# EAGLE design Schematic (EAGLE 9.6.2)

## Sheet 1 of 2
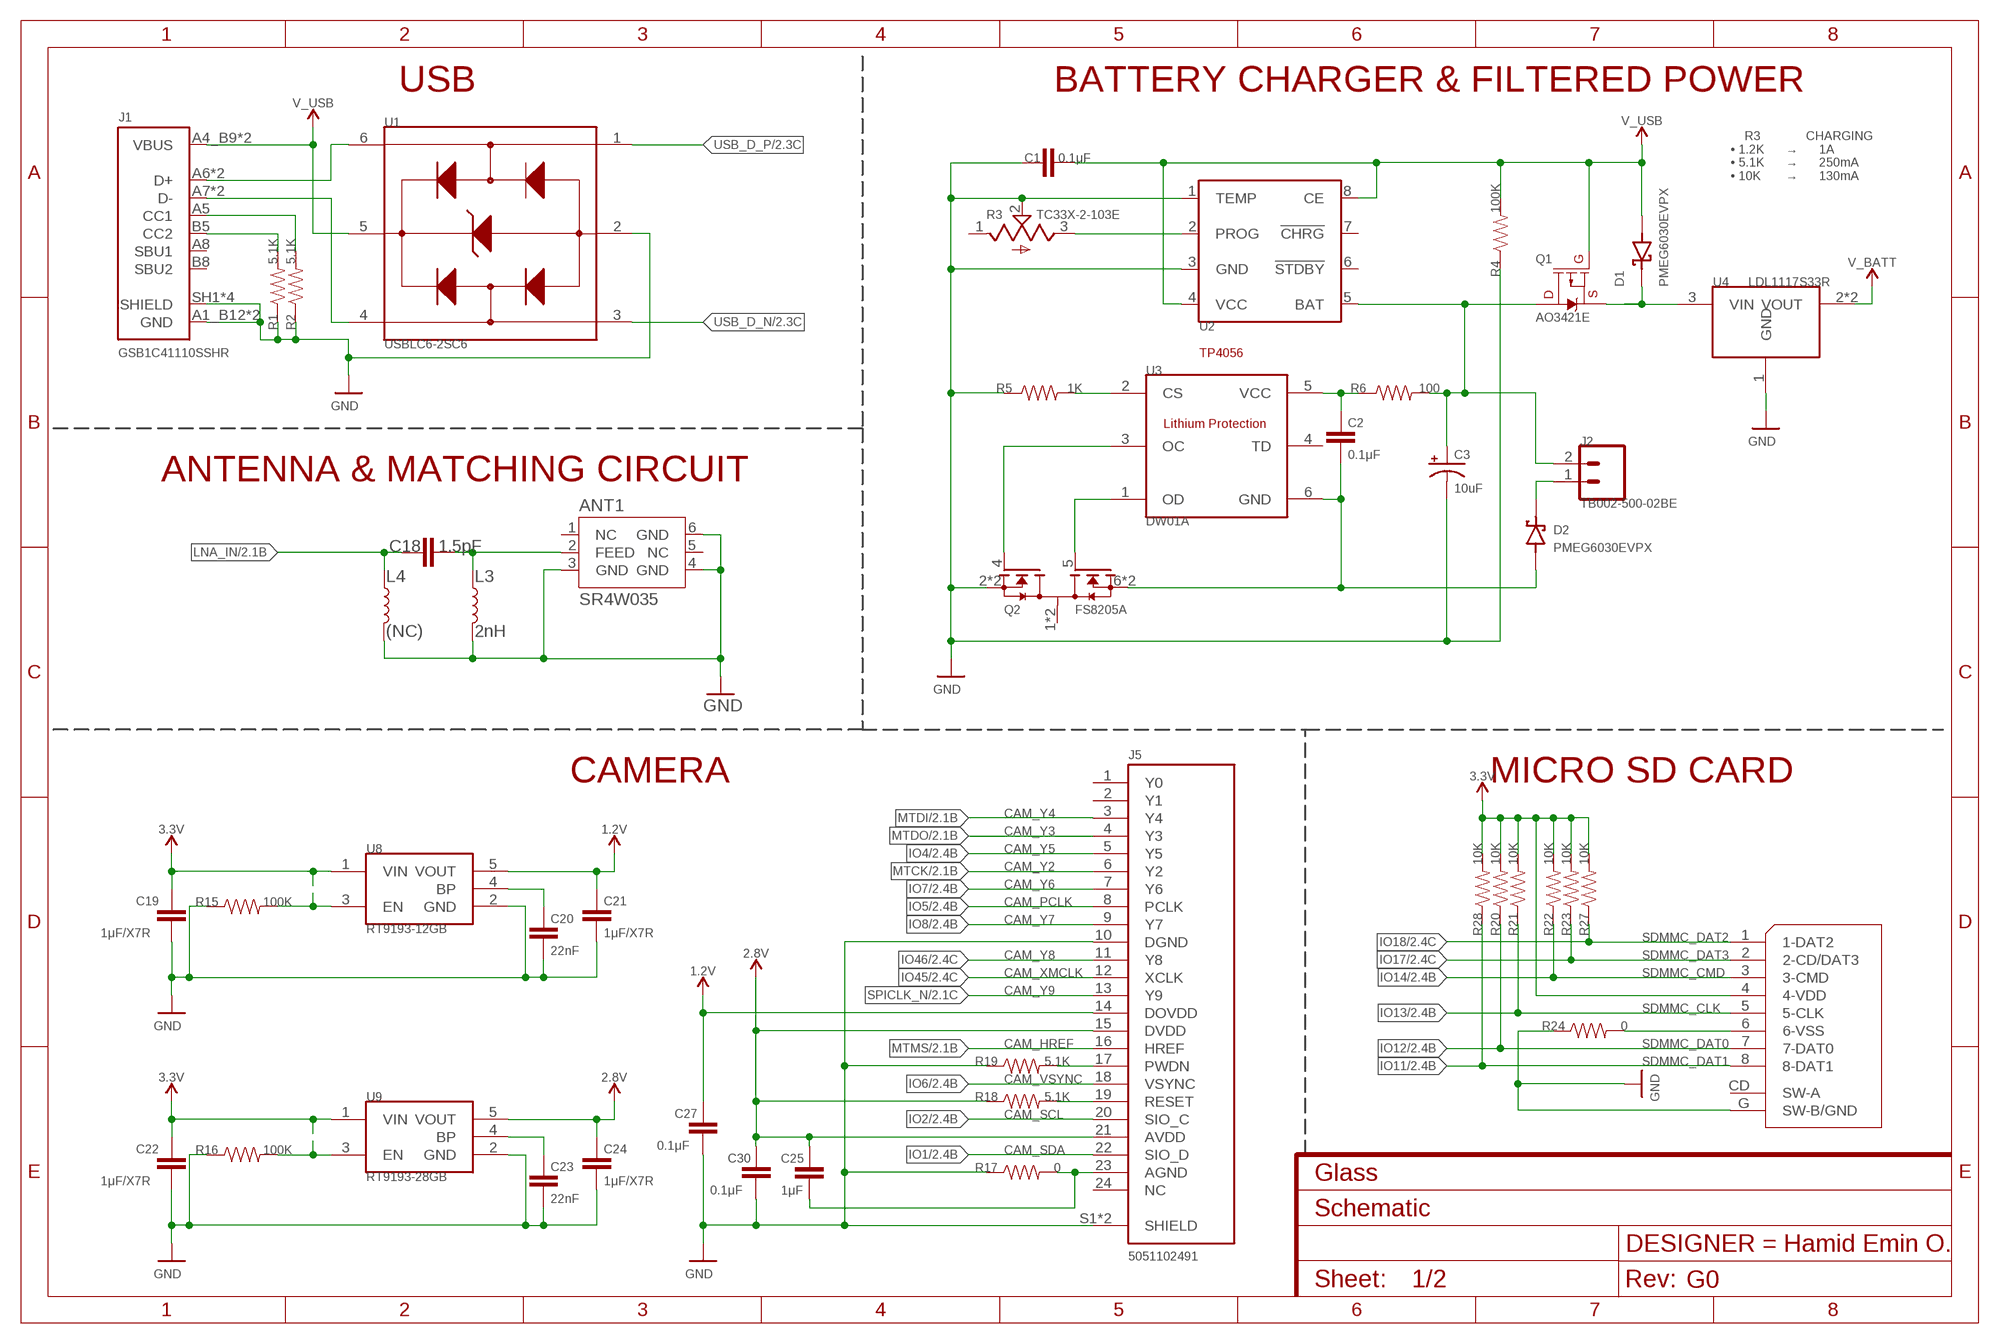
[diagram p0: schematic, sheet 1]
FRAME1 (FRAME-A4L): CNAME: Glass; CREVISION: G0; DESIGNER: Hamid Emin O.

### Parts
ANT1  SR4W035  [SR4W035]
C1  0.1μF  1.0UF-0805-25V-10%  [0805]
C2  0.1μF  1.0UF-0805-25V-10%  [0805]
C3  10uF  10UF-POLAR-RADIAL-2.5MM-25V-20%  [CPOL-RADIAL-2.5MM-5MM]
C18  1.5pF  15PF-0402-50V-5%  [0402]
C19  1μF/X7R  1.0UF-0805-25V-10%  [0805]
C20  22nF  10NF-0603-50V-10%  [0603]
C21  1μF/X7R  1.0UF-0805-25V-10%  [0805]
C22  1μF/X7R  1.0UF-0805-25V-10%  [0805]
C23  22nF  10NF-0603-50V-10%  [0603]
C24  1μF/X7R  1.0UF-0805-25V-10%  [0805]
C25  1μF  1.0UF-0805-25V-10%  [0805]
C27  0.1μF  1.0UF-0805-25V-10%  [0805]
C30  0.1μF  1.0UF-0805-25V-10%  [0805]
D1  PMEG6030EVPX  [DIO_PMEG6030EVPX]
D2  PMEG6030EVPX  [DIO_PMEG6030EVPX]
J1  GSB1C41110SSHR  [AMPHENOL_GSB1C41110SSHR]
J2  TB002-500-02BE  CONN_025MM  [SCREWTERMINAL-5MM-2]
J5  5051102491  [MOLEX_5051102491]
K1  112J-TDAR-R01  [112J-TDAR-R01]
L3  2nH  INDUCTOR-0402-3.9NH  [0402]
L4  (NC)  INDUCTOR-0402-3.9NH  [0402]
Q1  AO3421E  MOSFET_PCH-DMG2307L  [SOT23-3]
Q2  FS8205A  [SOP65P640X120-8N]
R1  5.1K  5.1KOHM5.1KOHM-0603-1/10W-1%  [0603]
R2  5.1K  5.1KOHM5.1KOHM-0603-1/10W-1%  [0603]
R3  TC33X-2-103E  [TRIM_TC33X-2-103E]
R4  100K  0OHM-0603-1/10W  [0603]
R5  1K  1KOHM-0603-1/10W-1%  [0603]
R6  100  100OHM-0603-1/10W-1%  [0603]
R15  100K  0OHM-0603-1/10W  [0603]
R16  100K  0OHM-0603-1/10W  [0603]
R17  0  0OHM-0603-1/10W  [0603]
R18  5.1K  5.1KOHM5.1KOHM-0603-1/10W-1%  [0603]
R19  5.1K  5.1KOHM5.1KOHM-0603-1/10W-1%  [0603]
R20  10K  5.1KOHM5.1KOHM-0603-1/10W-1%  [0603]
R21  10K  5.1KOHM5.1KOHM-0603-1/10W-1%  [0603]
R22  10K  5.1KOHM5.1KOHM-0603-1/10W-1%  [0603]
R23  10K  5.1KOHM5.1KOHM-0603-1/10W-1%  [0603]
R24  0  0OHM-0603-1/10W  [0603]
R27  10K  5.1KOHM5.1KOHM-0603-1/10W-1%  [0603]
R28  10K  5.1KOHM5.1KOHM-0603-1/10W-1%  [0603]
U1  USBLC6-2SC6  [SOT95P280X145-6N]
U2  TP4056  [SOT23-8]
U3  DW01A  [SOT23-6]
U4  LDL1117S33R  [SOT230P700X180-4N]
U8  RT9193-12GB  RT9193-33GB  [SOT94P279X129-5N]
U9  RT9193-28GB  RT9193-33GB  [SOT94P279X129-5N]

### Nets
1.1V: C21.2 C27.2 J5.14(DOVDD) U8.5(VOUT) ; supply symbol labelled 1.2V
2.8V: C24.2 C25.2 C30.2 J5.15(DVDD) J5.21(AVDD) R18.1 U9.5(VOUT)
3.3V: C19.2 C22.2 K1.4(4-VDD) R15.2 R16.2 R20.2 R21.2 R22.2 R23.2 R27.2 R28.2 U8.1(VIN) U8.3(EN) U9.1(VIN) U9.3(EN) ; also sheet 2
GND: ANT1.3(GND) ANT1.4(GND) ANT1.6(GND) C1.1 C3.2(-) C19.1 C20.1 C21.1 C22.1 C23.1 C24.1 C27.1 C30.1 J1.A1_B12(GND) J1.B1_A12(GND) J1.SH1(SHIELD) J1.SH2(SHIELD) J1.SH3(SHIELD) J1.SH4(SHIELD) J5.10(DGND) J5.S1(SHIELD) J5.S2(SHIELD) K1.G(SW-B/GND) L3.2 L4.2 Q2.2(S1) Q2.3(S1) R1.1 R2.1 R3.2(W) R4.1 R5.1 R15.1 R16.1 R17.1 R19.1 R24.1 U1.2(GND) U2.1(TEMP) U2.3(GND) U4.1(GND) U8.2(GND) U9.2(GND) ; also sheet 2
IO1: J5.22(SIO_D) ; also sheet 2
IO2: J5.20(SIO_C) ; also sheet 2
IO4: J5.5(Y5) ; also sheet 2
IO5: J5.8(PCLK) ; also sheet 2
IO6: J5.18(VSYNC) ; also sheet 2
IO7: J5.7(Y6) ; also sheet 2
IO8: J5.9(Y7) ; also sheet 2
IO11: K1.8(8-DAT1) R28.1 ; also sheet 2
IO12: K1.7(7-DAT0) R20.1 ; also sheet 2
IO13: K1.5(5-CLK) R21.1 ; also sheet 2
IO14: K1.3(3-CMD) R22.1 ; also sheet 2
IO17: K1.2(2-CD/DAT3) R23.1 ; also sheet 2
IO18: K1.1(1-DAT2) R27.1 ; also sheet 2
IO45: J5.12(XCLK) ; also sheet 2
IO46: J5.11(Y8) ; also sheet 2
LNA_IN: C18.1 L4.1 ; also sheet 2
MTCK: J5.6(Y2) ; also sheet 2
MTDI: J5.3(Y4) ; also sheet 2
MTDO: J5.4(Y3) ; also sheet 2
MTMS: J5.16(HREF) ; also sheet 2
N$1: J1.A7(D-) J1.B7(D-) U1.4(I/O2_OUT)
N$2: Q2.5(G2) U3.1(OD)
N$3: Q2.4(G1) U3.3(OC)
N$4: J1.A5(CC1) R2.2
N$5: R5.2 U3.2(CS)
N$6: J1.B5(CC2) R1.2
N$7: K1.6(6-VSS) R24.2
N$8: R3.3(CW) U2.2(PROG)
N$10: D2.1(K) J2.1
N$11: C2.2 R6.1 U3.5(VCC)
N$12: ANT1.2(FEED) C18.2 L3.1
N$14: J1.A6(D+) J1.B6(D+) U1.6(I/O1_OUT)
N$15: C2.1 D2.2(A) Q2.6(S2) Q2.7(S2) U3.6(GND)
N$16: C20.2 U8.4(BP)
N$17: C23.2 U9.4(BP)
N$19: J5.19(RESET) R18.2
N$23: C3.1(+) J2.2 Q1.3(D) R6.2 U2.5(BAT)
N$28: D1.1(K) Q1.2(S) U4.3(VIN)
N$45: J5.17(PWDN) R19.2
N$50: C25.1 J5.23(AGND) R17.2
SPICLK_N: J5.13(Y9) ; also sheet 2
USB_D_N: U1.3(I/O2_IN) ; also sheet 2
USB_D_P: U1.1(I/O1_IN) ; also sheet 2
V_BATT: U4.2(VOUT) U4.4(VOUT) ; also sheet 2
V_USB: C1.2 D1.2(A) J1.A4_B9(VBUS) J1.B4_A9(VBUS) Q1.1(G) R4.2 U1.5(VBUS) U2.4(VCC) U2.8(CE)
Unconnected: ANT1.1(NC) ANT1.5(NC) J1.A8(SBU1) J1.B8(SBU2) J5.1(Y0) J5.2(Y1) J5.24(NC) K1.CD(SW-A) Q2.1(D12) Q2.8(D12) R3.1(CCW) U2.6(!STDBY) U2.7(!CHRG) U3.4(TD)

### Notes on the sheet
- USB | BATTERY CHARGER & FILTERED POWER
- R3             CHARGING
  • 1.2K      →      1A
  • 5.1K      →      250mA
  • 10K       →      130mA
- ANTENNA & MATCHING CIRCUIT
- CAMERA | MICRO SD CARD
- CAM_Y4
- CAM_Y3
- CAM_Y5
- CAM_Y2
- CAM_Y6
- CAM_PCLK
- CAM_Y7
- CAM_Y8
- CAM_XMCLK
- CAM_Y9
- CAM_HREF
- CAM_VSYNC
- CAM_SCL
- CAM_SDA

## Sheet 2 of 2
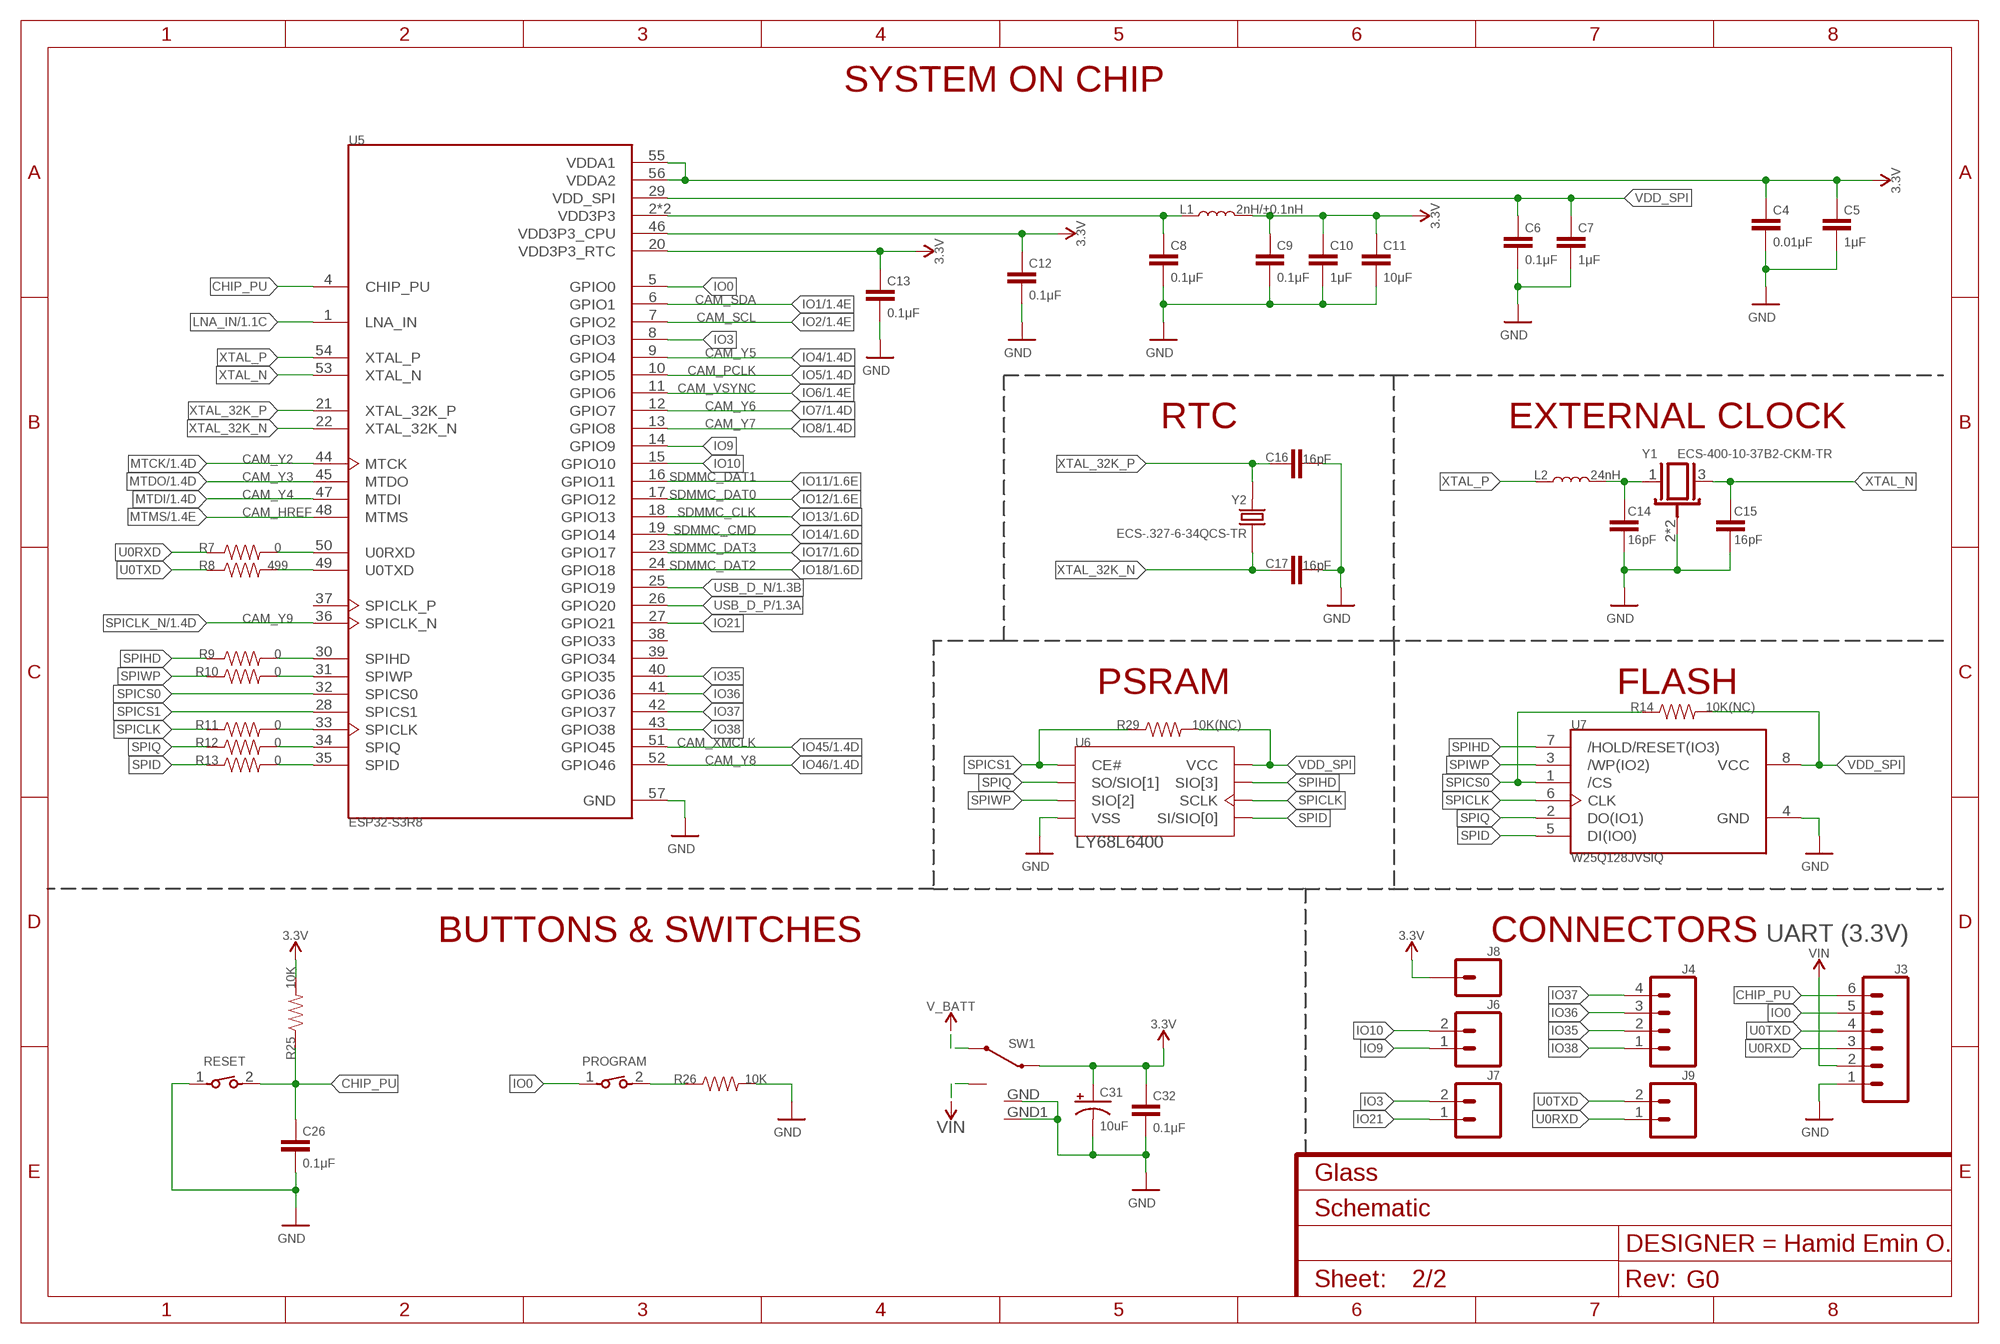
[diagram p1: schematic, sheet 2]
FRAME2 (FRAME-A4L): CNAME: Glass; CREVISION: G0; DESIGNER: Hamid Emin O.

### Parts
C4  0.01μF  10NF-0603-50V-10%  [0603]
C5  1μF  1.0UF-0805-25V-10%  [0805]
C6  0.1μF  1.0UF-0805-25V-10%  [0805]
C7  1μF  1.0UF-0805-25V-10%  [0805]
C8  0.1μF  1.0UF-0805-25V-10%  [0805]
C9  0.1μF  1.0UF-0805-25V-10%  [0805]
C10  1μF  1.0UF-0805-25V-10%  [0805]
C11  10μF  1.0UF-0805-25V-10%  [0805]
C12  0.1μF  1.0UF-0805-25V-10%  [0805]
C13  0.1μF  1.0UF-0805-25V-10%  [0805]
C14  16pF  0.1UF-0402-16V-10%  [0402]
C15  16pF  0.1UF-0402-16V-10%  [0402]
C16  16pF  0.1UF-0402-16V-10%  [0402]
C17  16pF  0.1UF-0402-16V-10%  [0402]
C26  0.1μF  1.0UF-0805-25V-10%  [0805]
C31  10uF  10UF-POLAR-RADIAL-2.5MM-25V-20%  [CPOL-RADIAL-2.5MM-5MM]
C32  0.1μF  1.0UF-0805-25V-10%  [0805]
J3  CONN_06SILK_FEMALE_PTH  [1X06]
J4  CONN_04PTH  [1X04]
J6  CONN_02  [1X02]
J7  CONN_02  [1X02]
J8  CONN_01  [1X01]
J9  CONN_02  [1X02]
L1  2nH/±0.1nH  INDUCTOR-0402-3.9NH  [0402]
L2  24nH  INDUCTOR-0603-15NH  [0603]
PROGRAM  434121043816  [434121043816]
R7  0  0OHM-0603-1/10W  [0603]
R8  499  0OHM-0603-1/10W  [0603]
R9  0  0OHM-0603-1/10W  [0603]
R10  0  0OHM-0603-1/10W  [0603]
R11  0  0OHM-0603-1/10W  [0603]
R12  0  0OHM-0603-1/10W  [0603]
R13  0  0OHM-0603-1/10W  [0603]
R14  10K(NC)  5.1KOHM5.1KOHM-0603-1/10W-1%  [0603]
R25  10K  5.1KOHM5.1KOHM-0603-1/10W-1%  [0603]
R26  10K  5.1KOHM5.1KOHM-0603-1/10W-1%  [0603]
R29  10K(NC)  5.1KOHM5.1KOHM-0603-1/10W-1%  [0603]
RESET  434121043816  [434121043816]
SW1  1825232-1  [1825232-1]
U5  ESP32-S3R8  ESP32-S3  [IC_ESP32-S3]
U6  LY68L6400  [SOP]
U7  W25Q128JVSIQ  [SOIC127P790X216-8N]
Y1  ECS-400-10-37B2-CKM-TR  [XTAL_ECS-400-10-37B2-CKM-TR]
Y2  ECS-.327-6-34QCS-TR  [XTAL_ECS-.327-6-34QCS-TR]

### Nets
3.3V: C4.2 C5.2 C9.2 C10.2 C11.2 C12.2 C13.2 C31.1(+) C32.2 J8.1 L1.2 R25.2 SW1.2 U5.20(VDD3P3_RTC) U5.46(VDD3P3_CPU) U5.55(VDDA1) U5.56(VDDA2) ; also sheet 1
CHIP_PU: C26.2 J3.6 R25.1 RESET.2 U5.4(CHIP_PU)
GND: C4.1 C5.1 C6.1 C7.1 C8.1 C9.1 C10.1 C11.1 C12.1 C13.1 C14.1 C15.1 C16.2 C17.2 C26.1 C31.2(-) C32.1 J3.1 R26.2 RESET.1 SW1.GND SW1.GND1 U5.57(GND) U6.VSS U7.4(GND) Y1.2(GND) Y1.4(GND) ; also sheet 1
IO0: J3.5 PROGRAM.1 U5.5(GPIO0)
IO1: U5.6(GPIO1) ; also sheet 1
IO2: U5.7(GPIO2) ; also sheet 1
IO3: J7.2 U5.8(GPIO3)
IO4: U5.9(GPIO4) ; also sheet 1
IO5: U5.10(GPIO5) ; also sheet 1
IO6: U5.11(GPIO6) ; also sheet 1
IO7: U5.12(GPIO7) ; also sheet 1
IO8: U5.13(GPIO8) ; also sheet 1
IO9: J6.1 U5.14(GPIO9)
IO10: J6.2 U5.15(GPIO10)
IO11: U5.16(GPIO11) ; also sheet 1
IO12: U5.17(GPIO12) ; also sheet 1
IO13: U5.18(GPIO13) ; also sheet 1
IO14: U5.19(GPIO14) ; also sheet 1
IO17: U5.23(GPIO17) ; also sheet 1
IO18: U5.24(GPIO18) ; also sheet 1
IO21: J7.1 U5.27(GPIO21)
IO35: J4.2 U5.40(GPIO35)
IO36: J4.3 U5.41(GPIO36)
IO37: J4.4 U5.42(GPIO37)
IO38: J4.1 U5.43(GPIO38)
IO45: U5.51(GPIO45) ; also sheet 1
IO46: U5.52(GPIO46) ; also sheet 1
LNA_IN: U5.1(LNA_IN) ; also sheet 1
MTCK: U5.44(MTCK) ; also sheet 1
MTDI: U5.47(MTDI) ; also sheet 1
MTDO: U5.45(MTDO) ; also sheet 1
MTMS: U5.48(MTMS) ; also sheet 1
N$9: C8.2 L1.1 U5.2(VDD3P3) U5.3(VDD3P3)
N$13: C14.2 L2.2 Y1.1
N$20: PROGRAM.2 R26.1
N$21: R7.2 U5.50(U0RXD)
N$22: R8.2 U5.49(U0TXD)
N$25: R9.2 U5.30(SPIHD)
N$26: R10.2 U5.31(SPIWP)
N$29: R11.2 U5.33(SPICLK)
N$30: R12.2 U5.34(SPIQ)
N$31: R13.2 U5.35(SPID)
SPICLK: R11.1 U6.SCLK U7.6(CLK)
SPICLK_N: U5.36(SPICLK_N) ; also sheet 1
SPICS0: R14.1 U5.32(SPICS0) U7.1(/CS)
SPICS1: R29.1 U5.28(SPICS1) U6.CE#
SPID: R13.1 U6.SI/SIO[0] U7.5(DI(IO0))
SPIHD: R9.1 U6.SIO[3] U7.7(/HOLD/RESET(IO3))
SPIQ: R12.1 U6.SO/SIO[1] U7.2(DO(IO1))
SPIWP: R10.1 U6.SIO[2] U7.3(/WP(IO2))
U0RXD: J3.3 J9.1 R7.1
U0TXD: J3.4 J9.2 R8.1
USB_D_N: U5.25(GPIO19) ; also sheet 1
USB_D_P: U5.26(GPIO20) ; also sheet 1
V_BATT: SW1.3 ; also sheet 1
VDD_SPI: C6.2 C7.2 R14.2 R29.2 U5.29(VDD_SPI) U6.VCC U7.8(VCC)
VIN: J3.2 SW1.1
XTAL_32K_N: C17.1 U5.22(XTAL_32K_N) Y2.1(I/O)
XTAL_32K_P: C16.1 U5.21(XTAL_32K_P) Y2.2(O/I)
XTAL_N: C15.2 U5.53(XTAL_N) Y1.3
XTAL_P: L2.1 U5.54(XTAL_P)
Unconnected: U5.37(SPICLK_P) U5.38(GPIO33) U5.39(GPIO34)

### Notes on the sheet
- SYSTEM ON CHIP
- RTC | EXTERNAL CLOCK
- PSRAM | FLASH
- BUTTONS & SWITCHES | CONNECTORS | UART (3.3V)

## Library data of the parts
ANT1 = SR4W035:SR4W035
C1 C2 C5-C13 C19 C21 C22 C24-C27 C30 C32 = SparkFun-Capacitors:1.0UF: 1µF ceramic capacitors A capacitor is a passive two-terminal electrical component used to store electrical energy temporarily in an electric field.; PROD_ID: CAP-08064; VALUE: 1.0uF
C3 C31 = SparkFun-Capacitors:10UF-POLAR: 10.0µF polarized capacitors A capacitor is a passive two-terminal electrical component used to store electrical energy temporarily in an electric field.; PROD_ID: CAP-08440
C4 C20 C23 = SparkFun-Capacitors:10NF: 0.01uF/10nF/10,000pF ceramic capacitors A capacitor is a passive two-terminal electrical component used to store electrical energy temporarily in an electric field. CAP-09321; PROD_ID: CAP-00867; VALUE: 10nF
C14-C17 = SparkFun-Capacitors:0.1UF: 0.1µF ceramic capacitors A capacitor is a passive two-terminal electrical component used to store electrical energy temporarily in an electric field.; PROD_ID: CAP-12416; VALUE: 0.1uF
C18 = SparkFun-Capacitors:15PF: 15pF ceramic capacitors A capacitor is a passive two-terminal electrical component used to store electrical energy temporarily in an electric field.; PROD_ID: CAP-13063; VALUE: 15pF
D1 D2 = PMEG6030EVPX:PMEG6030EVPX: PMEG6030 Series 60 V 3 A Surface Mount Schottky Barrier Rectifier - SOD-128 Check availability <https://pricing.snapeda.com/parts/PMEG6030EVPX/Nexperia%20USA%20Inc./view-part?ref=eda>; AVAILABILITY: In Stock; CHECK_PRICES: https://www.snapeda.com/parts/PMEG6030EVPX/Nexperia/view-part/?ref=eda; DESCRIPTION: Diode Schottky 60 V 3A Surface Mount SOD-128/CFP5; MF: Nexperia USA Inc.; MP: PMEG6030EVPX; PACKAGE: CFP5-2 Nexperia USA Inc.; PRICE: None; PURCHASE-URL: https://www.snapeda.com/api/url_track_click_mouser/?unipart_id=7740717&manufacturer=Nexperia USA Inc.&part_name=PMEG6030EVPX&search_term=None; SNAPEDA_LINK: https://www.snapeda.com/parts/PMEG6030EVPX/Nexperia/view-part/?ref=snap
J1 = GSB1C41110SSHR:GSB1C41110SSHR: Check availability <https://pricing.snapeda.com/parts/GSB1C41110SSHR/Amphenol%20Canada/view-part?ref=eda>; AVAILABILITY: In Stock; CHECK_PRICES: https://www.snapeda.com/parts/GSB1C41110SSHR/Amphenol/view-part/?ref=eda; DESCRIPTION: USB2.0, Type C, Top mount, Center Height 1.63mm, Single Row Surface Mount; MF: Amphenol Canada; MP: GSB1C41110SSHR; PACKAGE: None; PRICE: None; SNAPEDA_LINK: https://www.snapeda.com/parts/GSB1C41110SSHR/Amphenol/view-part/?ref=snap
J2 = SparkFun-Connectors:CONN_02: Multi connection point. Often used as Generic Header-pin footprint for 0.1 inch spaced/style header connections On any of the 0.1 inch spaced packages, you can populate with these: Break Away Headers - Straight <https://www.sparkfun.com/products/116> (PRT-00116) Break Away Male Headers - Right Angle <https://www.sparkfun.com/products/553> (PRT-00553) Female Headers <https://www.sparkfun.com/products/115> (PRT-00115) Break Away Headers - Machine Pin <https://www.sparkfun.com/products/117> (PRT-00117) Break Away Female Headers - Swiss Machine Pin <https://www.sparkfun.com/products/743> (PRT-00743) For SCREWTERMINALS and SPRING TERMINALS visit here: Screw Terimnals on SparkFun.com <https://www.sparkfun.com/search/results?term=Screw+Terminals> (5mm/3.5mm/2.54mm spacing) This device is also useful as a general connection point to wire up your design to another part of your project. Our various solder wires solder well into these plated through hole pads. Hook-Up Wire - Assortment (Stranded, 22 AWG) <https://www.sparkfun.com/products/11375> (PRT-11375) Hook-Up Wire - Assortment (Solid Core, 22 AWG) <https://www.sparkfun.com/products/11367> (PRT-11367) View the entire wire category on our website here <https://www.sparkfun.com/categories/141> Special notes: Molex polarized connector foot print use with: PRT-08233 with associated crimp pins and housings. 2.54_SCREWTERM for use with PRT-10571. 3.5mm Screw Terminal footprints for PRT-08084 5mm Screw Terminal footprints for use with PRT-08432; SF_SKU: PRT-08432
J3 = SparkFun-Connectors:CONN_06: Multi connection point. Often used as Generic Header-pin footprint for 0.1 inch spaced/style header connections On any of the 0.1 inch spaced packages, you can populate with these: Break Away Headers - Straight <https://www.sparkfun.com/products/116> (PRT-00116) Break Away Male Headers - Right Angle <https://www.sparkfun.com/products/553> (PRT-00553) Female Headers <https://www.sparkfun.com/products/115> (PRT-00115) Break Away Headers - Machine Pin <https://www.sparkfun.com/products/117> (PRT-00117) Break Away Female Headers - Swiss Machine Pin <https://www.sparkfun.com/products/743> (PRT-00743) Arduino Stackable Header - 6 Pin <https://www.sparkfun.com/products/9280> (PRT-09280) Screw Terminals 2.54mm Pitch (6-Pin) <https://www.sparkfun.com/products/16499> (PRT-16499) For SCREWTERMINALS and SPRING TERMINALS visit here: Screw Terimnals on SparkFun.com <https://www.sparkfun.com/search/results?term=Screw+Terminals> (5mm/3.5mm/2.54mm spacing) This device is also useful as a general connection point to wire up your design to another part of your project. Our various solder wires solder well into these plated through hole pads. Hook-Up Wire - Assortment (Stranded, 22 AWG) <https://www.sparkfun.com/products/11375> (PRT-11375) Hook-Up Wire - Assortment (Solid Core, 22 AWG) <https://www.sparkfun.com/products/11367> (PRT-11367) View the entire wire category on our website here <https://www.sparkfun.com/categories/141>; PROD_ID: CONN-08437
J4 = SparkFun-Connectors:CONN_04: Multi connection point. Often used as Generic Header-pin footprint for 0.1 inch spaced/style header connections On any of the 0.1 inch spaced packages, you can populate with these: Break Away Headers - Straight <https://www.sparkfun.com/products/116> (PRT-00116) Break Away Male Headers - Right Angle <https://www.sparkfun.com/products/553> (PRT-00553) Female Headers <https://www.sparkfun.com/products/115> (PRT-00115) Break Away Headers - Machine Pin <https://www.sparkfun.com/products/117> (PRT-00117) Break Away Female Headers - Swiss Machine Pin <https://www.sparkfun.com/products/743> (PRT-00743) For SCREWTERMINALS and SPRING TERMINALS visit here: Screw Terimnals on SparkFun.com <https://www.sparkfun.com/search/results?term=Screw+Terminals> (5mm/3.5mm/2.54mm spacing) This device is also useful as a general connection point to wire up your design to another part of your project. Our various solder wires solder well into these plated through hole pads. Hook-Up Wire - Assortment (Stranded, 22 AWG) <https://www.sparkfun.com/products/11375> (PRT-11375) Hook-Up Wire - Assortment (Solid Core, 22 AWG) <https://www.sparkfun.com/products/11367> (PRT-11367) View the entire wire category on our website here <https://www.sparkfun.com/categories/141> Special notes: Molex polarized connector foot print use with SKU : PRT-08231 with associated crimp pins and housings. 1MM SMD Version SKU: PRT-10208; PROD_ID: CONN-09696
J5 = 5051102491:5051102491: Check availability <https://pricing.snapeda.com/parts/505110-2491/Molex/view-part?ref=eda>; AVAILABILITY: In Stock; CHECK_PRICES: https://www.snapeda.com/parts/505110-2491/Molex/view-part/?ref=eda; DESCRIPTION: Conn; Rect; Rt. Angle; FFC/FPC; 0.50MM Pitch; 24 Circuit; Bottom Contact; ZIF | Molex Incorporated 505110-2491; MF: Molex; MP: 505110-2491; PACKAGE: None; PRICE: None; PURCHASE-URL: https://www.snapeda.com/api/url_track_click_mouser/?unipart_id=699820&manufacturer=Molex&part_name=505110-2491&search_term=None; SNAPEDA_LINK: https://www.snapeda.com/parts/505110-2491/Molex/view-part/?ref=snap
J6 J7 J9 = SparkFun-Connectors:CONN_02: Multi connection point. Often used as Generic Header-pin footprint for 0.1 inch spaced/style header connections On any of the 0.1 inch spaced packages, you can populate with these: Break Away Headers - Straight <https://www.sparkfun.com/products/116> (PRT-00116) Break Away Male Headers - Right Angle <https://www.sparkfun.com/products/553> (PRT-00553) Female Headers <https://www.sparkfun.com/products/115> (PRT-00115) Break Away Headers - Machine Pin <https://www.sparkfun.com/products/117> (PRT-00117) Break Away Female Headers - Swiss Machine Pin <https://www.sparkfun.com/products/743> (PRT-00743) For SCREWTERMINALS and SPRING TERMINALS visit here: Screw Terimnals on SparkFun.com <https://www.sparkfun.com/search/results?term=Screw+Terminals> (5mm/3.5mm/2.54mm spacing) This device is also useful as a general connection point to wire up your design to another part of your project. Our various solder wires solder well into these plated through hole pads. Hook-Up Wire - Assortment (Stranded, 22 AWG) <https://www.sparkfun.com/products/11375> (PRT-11375) Hook-Up Wire - Assortment (Solid Core, 22 AWG) <https://www.sparkfun.com/products/11367> (PRT-11367) View the entire wire category on our website here <https://www.sparkfun.com/categories/141> Special notes: Molex polarized connector foot print use with: PRT-08233 with associated crimp pins and housings. 2.54_SCREWTERM for use with PRT-10571. 3.5mm Screw Terminal footprints for PRT-08084 5mm Screw Terminal footprints for use with PRT-08432
J8 = SparkFun-Connectors:CONN_01: Single connection point. Often used as Generic Header-pin footprint for 0.1 inch spaced/style header connections On any of the 0.1 inch spaced packages, you can populate with these: Break Away Headers - Straight <https://www.sparkfun.com/products/116> (PRT-00116) Break Away Male Headers - Right Angle <https://www.sparkfun.com/products/553> (PRT-00553) Female Headers <https://www.sparkfun.com/products/115> (PRT-00115) Break Away Headers - Machine Pin <https://www.sparkfun.com/products/117> (PRT-00117) Break Away Female Headers - Swiss Machine Pin <https://www.sparkfun.com/products/743> (PRT-00743) This device is also useful as a general connection point to wire up your design to another part of your project. Our various solder wires solder well into these plated through hole pads. Hook-Up Wire - Assortment (Stranded, 22 AWG) <https://www.sparkfun.com/products/11375> (PRT-11375) Hook-Up Wire - Assortment (Solid Core, 22 AWG) <https://www.sparkfun.com/products/11367> (PRT-11367) View the entire wire category on our website here <https://www.sparkfun.com/categories/141> Special notes: SMTSO-256-ET is a "flush mount" nut for a 4-40 screw. We mostly use this on specialty testbeds; it is a nice way to connect hardware to your PCB at an adjustable hieght. Also note, the SNAP packages are for using a snappable style connector. We sell a baggie of snaps and they are also used on two LilyPad designs: Snap Assortment - 30 pack (male and female) <https://www.sparkfun.com/products/11347> (DEV-11347) LilyPad Arduino SimpleSnap <https://www.sparkfun.com/products/10941> (DEV-10941) LilyPad SimpleSnap Protoboard <https://www.sparkfun.com/products/10940> (DEV-10940)
K1 = 112J-TDAR-R01:112J-TDAR-R01: Check availability <https://pricing.snapeda.com/parts/112J-TDAR-R01/Attend/view-part?ref=eda>; AVAILABILITY: In Stock; CHECK_PRICES: https://www.snapeda.com/parts/112J-TDAR-R01/Attend/view-part/?ref=eda; DESCRIPTION: 9 (8 + 1) Position Card Connector Secure Digital - microSD™ Surface Mount, Right Angle Gold; MF: Attend; MP: 112J-TDAR-R01; PACKAGE: None; PRICE: None; SNAPEDA_LINK: https://www.snapeda.com/parts/112J-TDAR-R01/Attend/view-part/?ref=snap
L1 L3 L4 = SparkFun-Coils:INDUCTOR: Inductors Resist changes in electrical current. Basically a coil of wire. SparkFun Products: SparkFun Load Cell Amplifier - HX711 <https://www.sparkfun.com/products/13879> IOIO-OTG - V2.2 <https://www.sparkfun.com/products/13613>; PROD_ID: NDUC-13457; VALUE: 3.9NH
L2 = SparkFun-Coils:INDUCTOR: Inductors Resist changes in electrical current. Basically a coil of wire. SparkFun Products: SparkFun Load Cell Amplifier - HX711 <https://www.sparkfun.com/products/13879> IOIO-OTG - V2.2 <https://www.sparkfun.com/products/13613>; PROD_ID: NDUC-11660; VALUE: 15nH
PROGRAM RESET = 434121043816:434121043816: WS-TASV SMT Tact Switch 6.0x3.5 mm MATERIAL PROPERTIES Cover Material Stainless Steel PROPERTIES Actuator Material LCP Actuator Flammability Rating UL94 V-0 Actuator Color Black; Salmon; White Frame Material LCP Frame Flammability Rating UL94 V-0 Frame Color Black; White Contact Material Stainless Steel Contact Plating Silver Terminal Material Copper Alloy Terminal Plating Silver VR 12 V (DC) Contact Resistance Initial 100 mΩ Contact Resistance After Life Test 1 Ω RISO 100 MΩ Withstanding Voltage 250 V (AC) Washable No Qty. 1500; 1800 Mechanical Properties Stroke 0.25 mm GENERAL INFORMATION Operating Temperature -40 up to +85 °C PACKAGING PROPERTIES Packaging Tape and Reel <https://www.we-online.com/catalog/media/o37582v209%20WS-TASV_4341X1XXX8X6_Family.jpg> Details see: https://www.we-online.com/catalog/en/TASV_6_0X3_5_SMD/ Created by Yingchun,Shan 2020-02-20 2020(C) Wurth Elektronik Check availability <https://pricing.snapeda.com/parts/434121043816/Wurth%20Elektronik/view-part?ref=eda>; AVAILABILITY: In Stock; CHECK_PRICES: https://www.snapeda.com/parts/434121043816/Wurth+Elektronik/view-part/?ref=eda; DESCRIPTION: Tactile Switch SPST-NO Top Actuated Surface Mount; MF: Wurth Elektronik; MP: 434121043816; PACKAGE: None; PRICE: None; PURCHASE-URL: https://www.snapeda.com/api/url_track_click_mouser/?unipart_id=4966086&manufacturer=Wurth Elektronik&part_name=434121043816&search_term=None; SNAPEDA_LINK: https://www.snapeda.com/parts/434121043816/Wurth+Elektronik/view-part/?ref=snap
Q1 = SparkFun-DiscreteSemi:MOSFET_PCH: P-channel MOSFETs Voltage controlled devices that allow control of high current outputs. SparkFun Products: SparkFun ESP32 Thing <https://www.sparkfun.com/products/13907> SparkFun ESP8266 Thing <https://www.sparkfun.com/products/13231> SparkFun Pi Servo HAT V2 <https://www.sparkfun.com/products/15316> DMG2305UX-7 (20V/4.2A/SOT23-3); PROD_ID: TRANS-11308; VALUE: 3.1A/30V/105mΩ
Q2 = FS8205A:FS8205A: N/A Check availability <https://pricing.snapeda.com/parts/FS8205A/Fortune%20Semiconductor/view-part?ref=eda>; AVAILABILITY: Not in stock; CHECK_PRICES: https://www.snapeda.com/parts/FS8205A/Fortune+Semiconductor/view-part/?ref=eda; MF: Fortune Semiconductor; MP: FS8205A; PACKAGE: Package; PRICE: None; SNAPEDA_LINK: https://www.snapeda.com/parts/FS8205A/Fortune+Semiconductor/view-part/?ref=snap
R1 R2 R14 R18-R23 R25-R29 = SparkFun-Resistors:5.1KOHM; PROD_ID: RES-12083; VALUE: 5.1k
R3 = TC33X-2-103E:TC33X-2-103E: Res Trimmer 100K Ohm 25% 1/10W 1(Elec)/1(Mech)Turn (3 X 3.8mm) Foot Print SMD Embossed T/R Check availability <https://pricing.snapeda.com/parts/TC33X-2-103E/Bourns/view-part?ref=eda>; AVAILABILITY: In Stock; CHECK_PRICES: https://www.snapeda.com/parts/TC33X-2-103E/Bourns/view-part/?ref=eda; DESCRIPTION: Trimmer, Rest 10 Kilohms, SMD, Pwr-Rtg 0.1W, Dim 0.15inLx0.118inWx0.047inH | Bourns TC33X-2-103E; MF: Bourns; MP: TC33X-2-103E; PACKAGE: SOD-23 Bourns; PRICE: None; PURCHASE-URL: https://www.snapeda.com/api/url_track_click_mouser/?unipart_id=47092&manufacturer=Bourns&part_name=TC33X-2-103E&search_term=None; SNAPEDA_LINK: https://www.snapeda.com/parts/TC33X-2-103E/Bourns/view-part/?ref=snap
R4 R8 R15 R16 = SparkFun-Resistors:0OHM: 0Ω resistor A resistor is a passive two-terminal electrical component that implements electrical resistance as a circuit element. Resistors act to reduce current flow, and, at the same time, act to lower voltage levels within circuits. - Wikipedia; PROD_ID: RES-08609; VALUE: 0
R5 = SparkFun-Resistors:1KOHM: 1kΩ resistor A resistor is a passive two-terminal electrical component that implements electrical resistance as a circuit element. Resistors act to reduce current flow, and, at the same time, act to lower voltage levels within circuits. - Wikipedia; PROD_ID: RES-07856; VALUE: 1k
R6 = SparkFun-Resistors:100OHM: 100Ω resistor A resistor is a passive two-terminal electrical component that implements electrical resistance as a circuit element. Resistors act to reduce current flow, and, at the same time, act to lower voltage levels within circuits. - Wikipedia; PROD_ID: RES-07863
R7 R9-R13 R17 R24 = SparkFun-Resistors:0OHM: 0Ω resistor A resistor is a passive two-terminal electrical component that implements electrical resistance as a circuit element. Resistors act to reduce current flow, and, at the same time, act to lower voltage levels within circuits. - Wikipedia; PROD_ID: RES-08609
SW1 = 1825232-1:1825232-1: Check availability <https://pricing.snapeda.com/parts/1825232-1/TE%20Connectivity/view-part?ref=eda>; AVAILABILITY: In Stock; CHECK_PRICES: https://www.snapeda.com/parts/1825232-1/TE+Connectivity+ALCOSWITCH+Switches/view-part/?ref=eda; COMMENT: 1825232-1; DESCRIPTION: Switch Slide ON None ON SPDT Side Slide 0.2A 30VDC 10000Cycle PC Pins Bracket Mount/Through Hole; MF: TE Connectivity; MP: 1825232-1; PACKAGE: None; PRICE: None; PURCHASE-URL: https://www.snapeda.com/api/url_track_click_mouser/?unipart_id=379421&manufacturer=TE Connectivity&part_name=1825232-1&search_term=None; SNAPEDA_LINK: https://www.snapeda.com/parts/1825232-1/TE+Connectivity+ALCOSWITCH+Switches/view-part/?ref=snap
U1 = USBLC6-2SC6:USBLC6-2SC6: Check availability <https://pricing.snapeda.com/parts/USBLC6-2SC6/STMicroelectronics/view-part?ref=eda> Check availability <https://pricing.snapeda.com/parts/USBLC6-2SC6/STMicroelectronics/view-part?ref=eda> Check availability <https://pricing.snapeda.com/parts/USBLC6-2SC6/STMicroelectronics/view-part?ref=eda>; AVAILABILITY: In Stock; CHECK_PRICES: https://www.snapeda.com/parts/USBLC6-2SC6/STMicroelectronics/view-part/?ref=eda; DESCRIPTION: 17V Clamp 5A (8/20µs) Ipp Tvs Diode Surface Mount SOT-23-6; MF: STMicroelectronics; MP: USBLC6-2SC6; PACKAGE: SOT-23-6 STMicroelectronics; PRICE: None; SNAPEDA_LINK: https://www.snapeda.com/parts/USBLC6-2SC6/STMicroelectronics/view-part/?ref=snap
U2 = TP4056:TP4056: TP4056 Data sheet <http://goo.gl/J7k8TF> Dave.Calaway Eagle Library <https://goo.gl/Muy1Tr>
U3 = DW01A:DW01A: The DW01A battery protection IC is designed to protect lithium-ion/polymer battery from damage or degrading the lifetime due to overcharge, overdischarge, and/or overcurrent for one-cell lithium-ion/polymer battery powered systems, such as cellular phones. Check availability <https://pricing.snapeda.com/parts/DW01A/Fortune%20Semiconductor/view-part?ref=eda>; AVAILABILITY: Not in stock; CHECK_PRICES: https://www.snapeda.com/parts/DW01A/Fortune+Semiconductor/view-part/?ref=eda; DESCRIPTION: One Cell Lithium-ion/Polymer Battery Protection IC; MF: Fortune Semiconductor; MP: DW01A; PACKAGE: SOT-23-6 Fortune Semiconductor; PRICE: None; SNAPEDA_LINK: https://www.snapeda.com/parts/DW01A/Fortune+Semiconductor/view-part/?ref=snap
U4 = LDL1117S33R:LDL1117S33R: Check availability <https://pricing.snapeda.com/parts/LDL1117S33R/STMicroelectronics/view-part?ref=eda>; AVAILABILITY: In Stock; CHECK_PRICES: https://www.snapeda.com/parts/LDL1117S33R/STMicroelectronics/view-part/?ref=eda; DESCRIPTION: Linear Voltage Regulator IC Positive Fixed 1 Output 1.2A SOT-223; MF: STMicroelectronics; MP: LDL1117S33R; PACKAGE: SOT-223 STMicroelectronics; PRICE: None; SNAPEDA_LINK: https://www.snapeda.com/parts/LDL1117S33R/STMicroelectronics/view-part/?ref=snap
U5 = ESP32-S3:ESP32-S3: Check availability <https://pricing.snapeda.com/parts/ESP32-S3/Espressif%20Systems/view-part?ref=eda>; AVAILABILITY: In Stock; CHECK_PRICES: https://www.snapeda.com/parts/ESP32-S3/Espressif+Systems/view-part/?ref=eda; DESCRIPTION: IC RF TxRx + MCU Bluetooth, WiFi 802.11b/g/n, Bluetooth v5.0 2.412GHz ~ 2.484GHz 56-VFQFN Exposed Pad; MF: Espressif Systems; MP: ESP32-S3; PACKAGE: None; PRICE: None; SNAPEDA_LINK: https://www.snapeda.com/parts/ESP32-S3/Espressif+Systems/view-part/?ref=snap
U6 = LY68L6400:LY68L6400: Designer: EyupBEY
U7 = W25Q128JVSIQ:W25Q128JVSIQ: Check availability <https://pricing.snapeda.com/parts/W25Q128JVSIQ/Winbond%20Electronics/view-part?ref=eda>; AVAILABILITY: In Stock; CHECK_PRICES: https://www.snapeda.com/parts/W25Q128JVSIQ/Winbond+Electronics/view-part/?ref=eda; DESCRIPTION: FLASH - NOR Memory IC 128Mb (16M x 8) SPI - Quad I/O, QPI, DTR 133 MHz 8-SOIC; MF: Winbond Electronics; MP: W25Q128JVSIQ; PACKAGE: SOIC-8 Winbond Electronics; PRICE: None; PURCHASE-URL: https://www.snapeda.com/api/url_track_click_mouser/?unipart_id=1054022&manufacturer=Winbond Electronics&part_name=W25Q128JVSIQ&search_term=None; SNAPEDA_LINK: https://www.snapeda.com/parts/W25Q128JVSIQ/Winbond+Electronics/view-part/?ref=snap
U8 U9 = RT9193:RT9193-33GB: RT9193 Series 300 mA 3.3 V Ultra-Low Noise Ultra-Fast CMOS LDO Regulator-SC-70-5 Check availability <https://pricing.snapeda.com/parts/RT9193-33GB/Richtek%20USA/view-part?ref=eda>; AVAILABILITY: In Stock; CHECK_PRICES: https://www.snapeda.com/parts/RT9193-33GB/Richtek+USA+Inc./view-part/?ref=eda; DESCRIPTION: Linear Voltage Regulator IC Positive Fixed 1 Output 300mA TSOT-23-5; MF: Richtek USA; MP: RT9193-33GB; PACKAGE: SOT-23-5 Richtek; PRICE: None; PURCHASE-URL: https://www.snapeda.com/api/url_track_click_mouser/?unipart_id=55570&manufacturer=Richtek USA&part_name=RT9193-33GB&search_term=None; SNAPEDA_LINK: https://www.snapeda.com/parts/RT9193-33GB/Richtek+USA+Inc./view-part/?ref=snap
Y1 = ECS-400-10-37B2-CKM-TR:ECS-400-10-37B2-CKM-TR: Check availability <https://pricing.snapeda.com/parts/ECS-400-10-37B2-CKM-TR/ECS%20Inc./view-part?ref=eda>; AVAILABILITY: In Stock; CHECK_PRICES: https://www.snapeda.com/parts/ECS-400-10-37B2-CKM-TR/ECS+Inc./view-part/?ref=eda; DESCRIPTION: Crystal 40MHz ±10ppm (Tol) ±10ppm (Stability) 10pF FUND 40Ohm 4-Pin Mini-CSMD T/R; MF: ECS Inc.; MP: ECS-400-10-37B2-CKM-TR; PACKAGE: SMD-4 ECS Inc.; PRICE: None; PURCHASE-URL: https://www.snapeda.com/api/url_track_click_mouser/?unipart_id=11456102&manufacturer=ECS Inc.&part_name=ECS-400-10-37B2-CKM-TR&search_term=None; SNAPEDA_LINK: https://www.snapeda.com/parts/ECS-400-10-37B2-CKM-TR/ECS+Inc./view-part/?ref=snap
Y2 = ECS-.327-6-34QCS-TR:ECS-.327-6-34QCS-TR: The ECX-34Q is a very compact SMD Tuning Fork Crystal with a 3.2 x 1.5 mm footprint Check availability <https://pricing.snapeda.com/parts/ECS-.327-6-34QCS-TR/ECS%20Inc./view-part?ref=eda>; AVAILABILITY: In Stock; CHECK_PRICES: https://www.snapeda.com/parts/ECS-.327-6-34QCS-TR/ECS+Inc./view-part/?ref=eda; DESCRIPTION: 32.768 kHz ±10ppm Crystal 6pF 70 kOhms 2-SMD, No Lead; MF: ECS Inc.; MP: ECS-.327-6-34QCS-TR; PACKAGE: SMD-2 ECS International; PRICE: None; PURCHASE-URL: https://www.snapeda.com/api/url_track_click_mouser/?unipart_id=2456560&manufacturer=ECS Inc.&part_name=ECS-.327-6-34QCS-TR&search_term=None; SNAPEDA_LINK: https://www.snapeda.com/parts/ECS-.327-6-34QCS-TR/ECS+Inc./view-part/?ref=snap

## Board
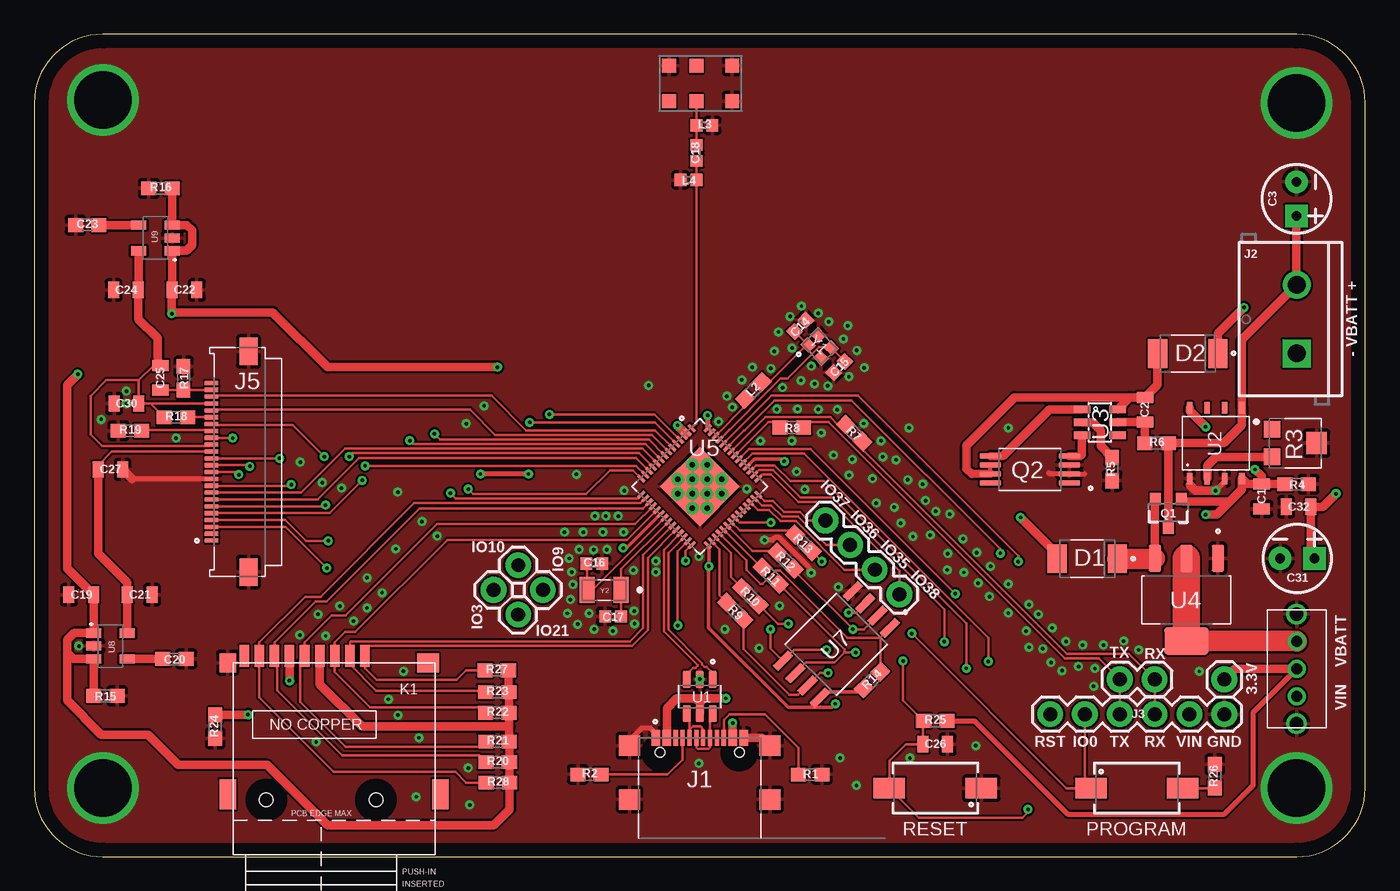
[diagram p2: board, top side]
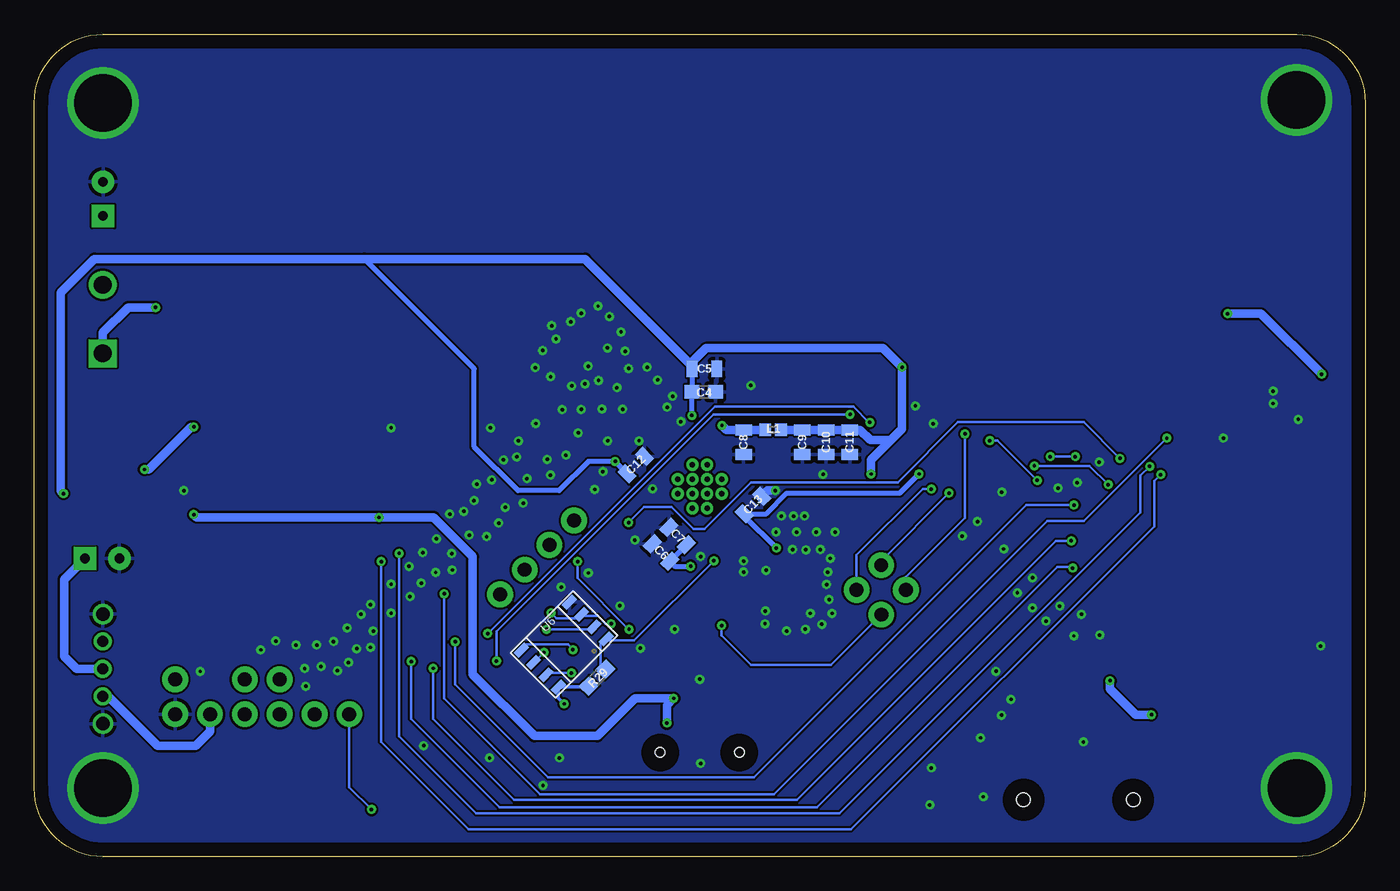
[diagram p3: board, bottom side, seen from below]

Size 97.08 x 60 mm. Coordinates in mm from the lower left corner, seen from the top.
Outline: 0,55 0,5 arc90 5,0 92.08,0 arc90 97.08,5 97.08,55 arc90 92.08,60 5,60 arc90 0,55
Copper layers (1*16): Top 0.035mm / dielectric 1.5mm / Bottom 0.035mm
Design rules "default": minimum track width 6mil, minimum drill 0.35mm, track to track 6mil, track to pad 6mil, pad to pad 6mil, via to via 6mil, smd to smd 6mil, copper to edge 40mil, drill to drill 6mil, minimum pad ring 10mil, minimum via ring 8mil, stop-mask expansion 4mil, vias tented up to drill 0mil, thermal gap 10mil

### Footprints (pad centres in the part's own frame; a part is rotated, then mirrored left to right if it is on the bottom)
SR4W035 = smd 1 x 1: 1 -2.04,-1.338; 2 -0.04,-1.338; 3 2.56,-1.338; 4 2.56,1.262; 5 -0.04,1.262; 6 -2.04,1.262
0805 = smd 0.8 x 1.2: 1 -0.9,0; 2 0.9,0
CPOL-RADIAL-2.5MM-5MM = drill 0.7 pad 1.651 square: 1 1.25,0 | drill 0.7 pad 1.651: 2 -1.25,0
0603 = smd 1.1 x 1: 1 -0.85,0; 2 0.85,0
0402 = smd 0.85 x 0.9: 1 -0.58,0; 2 0.58,0
DIO_PMEG6030EVPX = smd 1.4 x 2.1: 1 -2.2,0; 2 2.2,0
AMPHENOL_GSB1C41110SSHR = smd 0.6 x 1.15: A1_B12 -3.2,3.68; A4_B9 -2.4,3.68; B1_A12 3.2,3.68; B4_A9 2.4,3.68 | smd 0.3 x 1.15: A5 -1.25,3.68; A6 -0.25,3.68; A7 0.25,3.68; A8 1.25,3.68; B5 1.75,3.68; B6 0.75,3.68; B7 -0.75,3.68; B8 -1.75,3.68 | smd 1.5 x 1.5: SH1 -5.12,3.105; SH2 5.12,3.105; SH3 -5.12,-0.825; SH4 5.12,-0.825 | hole 0.7: -2.89,2.605; 2.89,2.605
SCREWTERMINAL-5MM-2 = drill 1.3 pad 2.032 square: 1 0,0 | drill 1.3 pad 2.032: 2 5,0
1X06 = drill 1.016 pad 1.88: 1 0,0; 2 2.54,0; 3 5.08,0; 4 7.62,0; 5 10.16,0; 6 12.7,0
1X04 = drill 1.016 pad 1.88: 1 0,0; 2 2.54,0; 3 5.08,0; 4 7.62,0
MOLEX_5051102491 = smd 0.3 x 1: 1 -5.75,2.7; 2 -5.25,2.7; 3 -4.75,2.7; 4 -4.25,2.7; 5 -3.75,2.7; 6 -3.25,2.7; 7 -2.75,2.7; 8 -2.25,2.7; 9 -1.75,2.7; 10 -1.25,2.7; 11 -0.75,2.7; 12 -0.25,2.7; 13 0.25,2.7; 14 0.75,2.7; 15 1.25,2.7; 16 1.75,2.7; 17 2.25,2.7; 18 2.75,2.7; 19 3.25,2.7; 20 3.75,2.7; 21 4.25,2.7; 22 4.75,2.7; 23 5.25,2.7; 24 5.75,2.7 | smd 2 x 1.3: S1 -8.05,0; S2 8.05,0
1X02 = drill 1.016 pad 1.88: 1 0,0; 2 2.54,0
1X01 = drill 1.016 pad 1.88: 1 0,0
112J-TDAR-R01 = smd 0.7 x 1.6: 1 7.2,10.5; 2 6.1,10.5; 3 5,10.5; 4 3.9,10.5; 5 2.8,10.5; 6 1.7,10.5; 7 0.6,10.5; 8 -0.5,10.5; CD -1.6,10.5 | smd 1.2 x 1.4: G -2.8,10 | smd 1.6 x 1.4: P$10 11.8,10 | smd 1.2 x 2.2: P$11 -2.8,0.4; P$12 12.7,0.4 | hole 1: 0,0; 8,0
434121043816 = smd 2.3 x 1.5: 1 -3.35,0; 2 3.35,0
SOT23-3 = smd 0.8 x 0.9: 1 -0.95,-1; 2 0.95,-1; 3 0,1.1
SOP65P640X120-8N = smd 1.56 x 0.4: 1 -2.88,0.975; 2 -2.88,0.325; 3 -2.88,-0.325; 4 -2.88,-0.975; 5 2.88,-0.975; 6 2.88,-0.325; 7 2.88,0.325; 8 2.88,0.975
TRIM_TC33X-2-103E = smd 1.2 x 1.2: 1 -1.8,1; 3 -1.8,-1 | smd 1.5 x 1.6: 2 1.45,0
1825232-1 = drill 0.8: 1 -2,0; 2 0,0; 3 2,0 | drill 1: GND -4,0; GND1 4,0
SOT95P280X145-6N = smd 1.21 x 0.59: 1 -1.255,0.95; 2 -1.255,0; 3 -1.255,-0.95; 4 1.255,-0.95; 5 1.255,0; 6 1.255,0.95
SOT23-8 = smd 0.42 x 0.835: 1 -1.905,-2.58; 2 -0.635,-2.58; 3 0.635,-2.58; 4 1.905,-2.58; 5 1.905,2.58; 6 0.635,2.58; 7 -0.635,2.58; 8 -1.905,2.58
SOT23-6 = smd 0.55 x 1.2: 1 -0.95,-1.3; 2 0,-1.3; 3 0.95,-1.3; 4 0.95,1.3; 5 0,1.3; 6 -0.95,1.3
SOT230P700X180-4N = smd 1.98 x 0.93: 1 -3.015,2.3; 2 -3.015,0; 3 -3.015,-2.3 | smd 1.98 x 3.23: 4 3.015,0
IC_ESP32-S3 = smd 0.65 x 0.22: 1 -3.425,2.6; 2 -3.425,2.2; 3 -3.425,1.8; 4 -3.425,1.4; 5 -3.425,1; 6 -3.425,0.6; 7 -3.425,0.2; 8 -3.425,-0.2; 9 -3.425,-0.6; 10 -3.425,-1; 11 -3.425,-1.4; 12 -3.425,-1.8; 13 -3.425,-2.2; 14 -3.425,-2.6; 29 3.425,-2.6; 30 3.425,-2.2; 31 3.425,-1.8; 32 3.425,-1.4; 33 3.425,-1; 34 3.425,-0.6; 35 3.425,-0.2; 36 3.425,0.2; 37 3.425,0.6; 38 3.425,1; 39 3.425,1.4; 40 3.425,1.8; 41 3.425,2.2; 42 3.425,2.6 | smd 0.22 x 0.65: 15 -2.6,-3.425; 16 -2.2,-3.425; 17 -1.8,-3.425; 18 -1.4,-3.425; 19 -1,-3.425; 20 -0.6,-3.425; 21 -0.2,-3.425; 22 0.2,-3.425; 23 0.6,-3.425; 24 1,-3.425; 25 1.4,-3.425; 26 1.8,-3.425; 27 2.2,-3.425; 28 2.6,-3.425; 43 2.6,3.425; 44 2.2,3.425; 45 1.8,3.425; 46 1.4,3.425; 47 1,3.425; 48 0.6,3.425; 49 0.2,3.425; 50 -0.2,3.425; 51 -0.6,3.425; 52 -1,3.425; 53 -1.4,3.425; 54 -1.8,3.425; 55 -2.2,3.425; 56 -2.6,3.425 | smd 4.1 x 4.1: 57 0,0 | drill 0.4 pad 0.5: 58 -0.75,1.5; 59 0.75,1.5; 60 -1.5,0.75; 61 0,0.75; 62 1.5,0.75; 63 -0.75,0; 64 0.75,0; 65 -1.5,-0.75; 66 0,-0.75; 67 1.5,-0.75; 68 -0.75,-1.5; 69 0.75,-1.5
SOP = smd 0.51 x 1.05: CE# -2.032,-2.41; SCLK 0.508,2.54; SI/SIO[0] 1.778,2.54; SIO[2] 0.508,-2.41; SIO[3] -0.762,2.54; SO/SIO[1] -0.762,-2.41; VCC -2.032,2.54; VSS 1.778,-2.41
SOIC127P790X216-8N = smd 1.61 x 0.58: 1 -3.605,1.905; 2 -3.605,0.635; 3 -3.605,-0.635; 4 -3.605,-1.905; 5 3.605,-1.905; 6 3.605,-0.635; 7 3.605,0.635; 8 3.605,1.905
SOT94P279X129-5N = smd 1.17 x 0.67: 1 -1.22,0.94; 2 -1.22,0; 3 -1.22,-0.94; 4 1.22,-0.94; 5 1.22,0.94
XTAL_ECS-400-10-37B2-CKM-TR = smd 0.75 x 0.85: 1 -0.525,0.675; 2 -0.525,-0.675; 3 0.525,-0.675; 4 0.525,0.675
XTAL_ECS-.327-6-34QCS-TR = smd 1.1 x 1.9: 1 -1.25,0; 2 1.25,0

### Placement (x,y rotation side)
ANT1  48.34,56.45 0 top
C1  89.53,26.28 90 top
C2  81.02,32.6 270 top
C3  92.06,47.99 270 top
C4  48.25,33.91 180 bottom
C5  48.2,35.58 180 bottom
C6  51.36,22.19 315 bottom
C7  50.15,23.39 315 bottom
C8  45.34,30.23 90 bottom
C9  41.05,30.23 90 bottom
C10  39.32,30.24 90 bottom
C11  37.6,30.24 90 bottom
C12  53.21,28.57 225 bottom
C13  44.66,25.66 225 bottom
C14  55.86,38.73 225 top
C15  58.71,35.72 45 top
C16  40.84,21.38 0 top
C17  42.22,17.53 180 top
C18  48.3,51.34 90 top
C19  3.43,19.1 0 top
C20  10.23,14.43 180 top
C21  7.69,19.1 180 top
C22  10.95,41.35 180 top
C23  3.86,46.08 0 top
C24  6.69,41.34 0 top
C25  9.2,34.94 90 top
C26  65.72,8.21 180 top
C27  5.55,28.25 180 top
C30  6.72,33.06 0 top
C31  92.12,21.76 0 top
C32  92.22,25.52 0 top
D1  76.8,21.74 180 top
D2  84.13,36.71 180 top
J1  48.54,5 0 top
J2  92.08,36.72 90 top
J3  86.8,10.4 180 top
J4  63.1,19.14 135 top
J5  15.63,28.81 90 top
J6  37.1,19.47 135 top
J7  35.3,17.66 135 top
J8  86.8,12.94 0 top
J9  81.72,12.94 180 top
K1  16.92,4.15 0 top
L1  43.19,31.14 0 bottom
L2  52.46,34.02 45 top
L3  48.88,53.35 0 top
L4  47.72,49.37 180 top
PROGRAM  80.42,5 0 top
Q1  82.72,25.1 180 top
Q2  72.62,28.25 180 top
R1  56.59,6 180 top
R2  40.5,6 0 top
R3  92.08,30.17 0 top
R4  92.08,27.18 180 top
R5  78.62,28.28 90 top
R6  81.87,30.17 0 top
R7  59.8,30.91 135 top
R8  55.26,31.32 180 top
R9  51.13,17.92 135 top
R10  52.23,19.01 135 top
R11  53.72,20.5 135 top
R12  54.81,21.6 135 top
R13  56.1,22.89 135 top
R14  61.1,12.88 225 top
R15  5.19,11.74 180 top
R16  9.21,48.76 0 top
R17  10.89,34.9 270 top
R18  10.34,32.05 0 top
R19  6.98,31.07 0 top
R20  33.8,6.9 0 top
R21  33.79,8.4 0 top
R22  33.78,10.5 0 top
R23  33.77,12 0 top
R24  13.2,9.49 90 top
R25  65.72,9.91 0 top
R26  86.11,5.88 90 top
R27  33.73,13.6 0 top
R28  33.82,5.4 0 top
R29  56.02,13.06 225 bottom
RESET  65.72,5 180 top
SW1  92.08,13.7 90 top
U1  48.54,11.68 270 top
U2  86.18,30.17 0 top
U3  77.72,31.68 270 top
U4  84.04,18.75 270 top
U5  48.54,27 315 top
U6  58.5,15.61 135 bottom
U7  58.51,15.49 225 top
U8  5.56,15.37 0 top
U9  8.84,45.14 180 top
Y1  57.29,37.22 45 top
Y2  41.56,19.45 180 top

### Tracks (layer width: path | path; a pad name or v marks a point on that pad's centre or on a via)
1.1V
  Top 0.18: C27.2 4.65,28.55 5.66,29.56 J5.14
  Top 0.635: U8.5 C21.2 6.79,20 4.65,22.14 C27.2
2.8V
  Top 0.18: C30.2 J5.21 | R18.1 8.48,33.06 C30.2 | C25.2 8.7,35.84 7.62,34.76 | C30.2 7.62,34.76 | 7.62,34.76 5.26,34.76 4.1,33.6 4.1,30.8 4.94,29.96 12.83,29.96 J5.15
  Top 0.635: C25.2 9,36.04 9,37.83 7.59,39.24 C24.2 7.62,41.37 U9.5
3.3V  (via drill 0.25)
  Top 0.254: U5.55 U5.56
  Top 0.27: U5.20 43.2,22.51 v42.96,22.51 | U5.46 52.52,29 54.55,29 v54.71,28.84
  Top 0.381: v49.11,32.19 49.11,31.27 U5.56 | R25.2 68.59,9.91 75.4,3.1 86.8,3.1 88.9,5.2 88.9,10.52 SW1.2 | v36.05,27.92 v32.55,27.92
  Top 0.635: R15.2 U8.3 2.84,14.43 2.4,14.87 | R16.2 U9.3 11.12,46.08 11.5,45.7 11.5,44.6 11.1,44.2 U9.1 C22.2 v10.04,39.62 10.12,39.7 17.4,39.7 21.39,35.71 v33.79,35.71 | v3.18,35.2 3.18,35.18 2.4,34.4 2.4,21.03 C19.2 U8.1 2.91,16.31 2.4,15.8 2.4,14.87 | R27.2 34.58,12.04 R23.2 R22.2 34.64,9.5 | 34.64,9.5 R21.2 R20.2 34.67,6.88 R28.2 34.67,3.47 33.5,2.3 21.4,2.3 17,6.7 10.5,6.7 8.3,8.9 4.9,8.9 2.4,11.4 2.4,14.87 | K1.4 20.82,12.58 23.9,9.5 34.64,9.5 | C31.1 93.12,22.01 C32.2 93.98,25.52 v94.95,26.49 | J8.1 87.56,13.7 SW1.2
  Bottom 0.381: v42.96,22.51 45.3,24.85 C13.2 43.68,25.02 42.18,26.52 33.95,26.52 v32.55,27.92 | v49.11,32.19 v49.1,32.2 C4.2 C5.2 49.1,35.8 49.1,36.1 | C12.2 53.84,27.97 v54.71,28.84 56.66,28.84 58.8,26.7 61.8,26.7 65,29.9 65,35.6 73,43.6
  Bottom 0.635: L1.2 C9.2 C10.2 C11.2 36.84,31.14 36.1,30.4 34.6,30.4 | v10.04,39.62 7.6,39.62 v3.18,35.2 | 34.6,30.4 33.8,31.2 v33.8,35.7 v33.79,35.71 35.18,37.1 48.1,37.1 49.1,36.1 | 34.6,30.4 36.05,28.95 v36.05,27.92 | SW1.2 94,13.7 94.9,14.6 94.9,20.23 C31.1 | 49.1,35.8 56.9,43.6 73,43.6 92.7,43.6 95.15,41.15 95.15,26.69 v94.95,26.49
CHIP_PU  (via drill 0.25)
  Top 0.152: 64.82,9.86 R25.1
  Top 0.18: 64.82,9.86 C26.2 63.57,8.21 62.37,7.01 RESET.2 64.53,2.84 72.08,2.84 72.48,3.24 v72.48,3.44 | U5.4 45.25,32.27 v37.57,32.27 | v63.37,14.27 63.37,11.41 R25.1
  Bottom 0.18: v37.57,32.27 47.53,32.27 63.37,16.43 v63.37,14.27 | J3.6 74.1,5.06 v72.48,3.44
GND  (via drill 0.25, 4.2)
  Top 0.381: J1.A1_B12 45.34,8.98 44.95,9.37 44.28,9.37 43.42,8.51 J1.SH1 | U1.2 v48.54,12.95 | 76.62,27.93 Q2.2 74.08,27.93 74,28 | U2.3 86.81,27.36 v86.17,26.71 v86.16,26.7 | U2.1 84.28,27.12 | J5.10 7.14,27.56 | v56.67,20.7 56.5,20.87 56.5,21.11 54.32,23.29 54.03,23.29 53.84,23.1 v53.27,23.1
  Top 0.635: 84.28,27.12 84.7,26.7 v86.16,26.7 | 7.14,27.56 C27.1 | J1.B1_A12 53.09,8.68 J1.SH2
  Bottom 0.635: C13.1 43.62,26.7 v43.03,26.7
  other vias: 5,5 5,55.2 92.08,55 92.08,5 43.7,20.9 45.34,21.57 45.34,20.77 43.76,17.92 42.21,16.46 40.84,16.6 42.98,23.68 42.59,24.84 41.69,24.84 40.89,24.84 40.03,23.68 38.67,23.68 41.48,23.68 29.39,23.39 19.36,16.17 21.25,16.11 20.69,17.69 28.27,24.45 43.78,17 40.81,22.39 39.75,22.4 39.2,20.76 39.28,19.86 39.11,18.76 38.88,17.75 39.63,16.95 40.48,17.75 41.77,22.41 57.88,34.34 56.68,35.79 55.92,34.75 63.8,31.29 59.42,35.02 60.55,35.68 59.99,36.94 59.02,37.77 59.34,38.74 57.95,39.03 57.19,39.65 55.96,40.17 55.13,39.42 54.28,38.28 55.28,37.12 53.98,36.88 53.72,35.62 52.38,35.71 51.61,34.79 54.16,32.65 55.67,32.66 57.19,32.64 58.57,32.62 60.5,31.6 61.89,29.17 62.86,28.95 63.72,27.5 64.8,27.18 65.01,25.98 65.75,25.19 66.78,24.99 67.75,23.19 68.75,22.19 69.75,21.19 71.05,19.89 72.55,18.39 73.25,17.69 74.25,16.69 75.25,15.69 80.55,15.09 77.99,15.44 76.48,15.44 77.36,13.73 52.97,30.33 55.26,30.33 58.3,29.3 59.67,28.99 59.44,27.83 61.14,27.58 61.42,25.79 63.2,24.34 62.73,25.49 64.09,23.36 65.36,23.47 66.63,22.12 66.6,20.92 67.81,20.74 68.86,19.97 69.67,18.98 71.05,17.78 72.36,16.47 72.56,15.27 73.56,15.17 74.16,14.17 74.96,13.57 76.16,13.87 77.27,12.44 79.47,15.74 61.77,30.33 84.98,13.52 56.92,34.49 57.41,30.92 50.51,33.59 50.91,32.79 54.58,34.21 6.71,33.06 6.71,33.96 49.92,31.74 22.29,18.29 23.29,17.19 3.26,15.37 27.86,4.37 31.76,3.77 20.56,8.37 31.66,6.47 28.06,8.67 26.52,10.32 25.83,11.48 26.93,13.53 44.81,34.39 4.88,31.9 71.05,31.29 58.64,19.67 39.54,27.89 48.47,6.8 48.47,21.9 50.37,16.6 54.37,18.3 52.87,15.2 26.37,22.45 24.27,20.35 24.27,18.15 25.37,19.25 59.97,5.2 63.87,7.2 68.67,8.1 26.51,26.59 22.41,26.89 21.01,27.29 19.41,28.79 31.51,31.59 55.61,28.09 56.21,26.79 32.81,32.89 58.77,7.2 51.97,26.83 39.01,21.76 10.34,30.54
  pour Top: -4.2,64.4 101.6,64.4 101.6,-4.1 -4.2,-4.1
  pour Bottom: -2.1,62.1 -2.1,-2.1 99.4,-2.1 99.4,62.1
IO0  (via drill 0.25)
  Top 0.18: U5.5 45.26,31.69 v36.14,31.69 | v64,16.28 75.28,5 PROGRAM.1 76.64,5.43 J3.5
  Bottom 0.18: v64,16.28 v63.99,16.28 47.43,32.84 37.33,32.84 36.18,31.69 v36.14,31.69
IO1
  Top 0.18: U5.6 45.28,31.11 35.86,31.11 33.34,33.63 13,33.63 J5.22
IO2
  Top 0.18: U5.7 45.05,30.77 33.62,30.77 31.77,32.62 12.99,32.62 J5.20
IO3  (via drill 0.25)
  Top 0.18: U5.8 44.83,30.43 29.61,30.43 v29.19,30.85
  Bottom 0.18: v29.19,30.85 29.19,24.71 33.5,20.4 J7.2
IO4  (via drill 0.25)
  Top 0.18: U5.9 44.59,30.1 27.64,30.1 v27.39,30.35 | v23.92,27.45 21.53,25.06 J5.5
  Bottom 0.18: v27.39,30.35 26.82,30.35 v23.92,27.45
IO5
  Top 0.18: U5.10 44.36,29.77 22.67,29.77 19.46,26.56 J5.8
IO6  (via drill 0.25)
  Top 0.18: U5.11 44.12,29.43 23.21,29.43 v22.97,29.19 v22.97,29.18 | J5.18 12.99,31.5 18.84,31.5 v21.16,29.18
  Bottom 0.18: v21.16,29.18 v22.97,29.18
IO7
  Top 0.18: U5.12 43.89,29.1 23.7,29.1 20.66,26.06 J5.7
IO8  (via drill 0.25)
  Top 0.18: U5.13 43.91,28.52 v24.13,28.52 | v24.13,28.52 | J5.9 18.65,27.06 v18.74,27.15
  Bottom 0.18: v24.13,28.52 20.11,28.52 v18.74,27.15
IO9  (via drill 0.25)
  Top 0.18: U5.14 43.67,28.19 41.99,28.19 40.26,26.45 32.02,26.45 v31.65,26.82
  Bottom 0.18: v31.65,26.82 32.28,26.82 37.1,22 J6.1
IO10  (via drill 0.25)
  Top 0.18: U5.15 43.98,26.12 30.75,26.12 v30.35,26.52
  Bottom 0.18: J6.2 35.3,21.57 v30.35,26.52
IO11
  Top 0.18: R28.1 31.51,5.4 30.72,6.19 21.84,6.19 16.42,11.61 K1.8 16.42,15.62 19.77,18.97 20.88,18.97 27.7,25.79 44.22,25.79 U5.16
IO12
  Top 0.18: R20.1 32.45,7.4 22.44,7.4 17.71,12.13 17.71,14.46 K1.7 17.52,15.62 20.53,18.63 21.32,18.63 28.11,25.42 44.41,25.42 U5.17
IO13
  Top 0.18: R21.1 32.54,8 22.7,8 19.4,11.3 19.4,14.31 K1.5 19.72,15.62 21.69,17.59 22.7,17.59 29.37,24.26 43.82,24.26 U5.18
IO14
  Top 0.18: R22.1 32.53,10.9 24.5,10.9 21.9,13.5 21.9,14.63 K1.3 21.92,15.62 22.69,16.39 23.42,16.39 30.14,23.11 43.23,23.11 U5.19
IO17
  Top 0.18: R23.1 32.82,12.1 24.94,12.1 23.02,14.02 K1.2 23.02,15.62 23.12,15.72 43.45,15.72 44.42,16.69 44.42,22.03 U5.23
IO18
  Top 0.18: U5.24 44.76,21.81 44.76,16.56 43.59,15.39 24.36,15.39 24.12,15.15 K1.1 24.12,13.75 24.96,12.91 30.82,12.91 31.51,13.6 R27.1
IO21  (via drill 0.25)
  Top 0.18: U5.27 46.92,22.27 46.92,16.89 v46.94,16.87
  Bottom 0.18: v46.94,16.87 46.94,16.14 44.8,14 38.96,14 J7.1
IO35
  Top 0.18: U5.40 52.79,25.3 53.6,25.3 54.42,24.48 55.56,24.48 59.1,20.94 J4.2
IO36
  Top 0.18: U5.41 52.59,26.13 53.09,25.63 53.73,25.63 54.56,24.81 55.7,24.81 57.78,22.73 J4.3
IO37
  Top 0.18: U5.42 53.25,25.96 53.87,25.96 54.7,25.14 55.84,25.14 56.45,24.53 J4.4
IO38
  Top 0.18: U5.43 53.1,27.89 53.73,27.89 55.73,25.89 58.07,25.89 63.1,20.86 J4.1
IO45  (via drill 0.25)
  Top 0.18: 50.47,29.85 U5.51 51.78,31.09 51.79,31.09 53.99,33.29 59.62,33.29 70.47,22.44 v70.47,22.13 | J5.12 15.64,28.56 v15.72,28.48
  Bottom 0.18: v70.47,22.13 70.47,8.77 64.85,3.15 38.35,3.15 16.4,25.1 16.4,27.8 v15.72,28.48
IO46  (via drill 0.25)
  Top 0.18: U5.52 53.76,33.63 60.06,33.63 71.77,21.93 v71.77,21.53 | J5.11 14.74,28.06 v14.92,27.88
  Bottom 0.18: v71.77,21.53 71.77,8.38 65.39,2 37.5,2 15.4,24.1 15.4,27.4 v14.92,27.88
LNA_IN
  Top 0.18: C18.1 L4.1 48.3,31.6 U5.1
MTCK  (via drill 0.25)
  Top 0.18: U5.44 52.87,28.22 53.87,28.22 55.87,26.22 58.21,26.22 66.38,18.05 v66.38,15.68 | J5.6 21.15,25.56 v21.24,25.65
  Bottom 0.18: v66.38,15.68 66.38,12.58 59.6,5.8 44.58,5.8 24.73,25.65 v21.24,25.65
MTDI  (via drill 0.25)
  Top 0.18: U5.47 52.37,29.42 56.13,29.42 69.58,15.97 v69.58,14.24 | J5.3 18.34,24.06 v21.34,21.06 v21.34,21.05
  Bottom 0.18: v69.58,14.24 69.58,10.04 63.14,3.6 39.99,3.6 22.44,21.15 21.44,21.15 v21.34,21.05
MTDO  (via drill 0.25)
  Top 0.18: U5.45 52.64,28.55 54.01,28.55 55.16,27.4 57.6,27.4 67.98,17.02 v67.98,13.74 | J5.4 18.31,24.56 19.82,23.05 v21.44,23.05
  Bottom 0.18: v67.98,13.74 67.98,10.04 62.07,4.13 41.47,4.13 22.55,23.05 v21.44,23.05
MTMS  (via drill 0.25)
  Top 0.18: U5.48 52.14,29.75 56.61,29.75 v67.18,19.18 | v67.18,19.18 | J5.16 14.44,30.56 v14.46,30.54 v14.47,30.54
  Bottom 0.18: v67.18,19.18 67.18,11.54 60.2,4.57 43.13,4.57 23.2,24.5 20.51,24.5 v14.47,30.54
N$1
  Top 0.18: J1.B7 47.79,9.3 | 47.79,9.3 47.79,10.22 U1.4 | J1.A7 48.79,9.3 48.59,9.5 48.04,9.5 47.84,9.3 47.79,9.3
N$2
  Top 0.59: Q2.5 70.64,29.23
  Top 0.635: 70.64,29.23 74.05,32.63 U3.1
N$3
  Top 0.59: 76.42,29.34 76.3,29.23 Q2.4
  Top 0.635: 76.42,29.34 U3.3
N$4
  Top 0.18: J1.A5 47.28,7.08 46.2,6 R2.2
N$5
  Top 0.635: U3.2 77.21,31.68 77.79,31.1 77.79,29.95 R5.2
N$6
  Top 0.18: J1.B5 50.29,9.99 50.7,10.4 53.3,10.4 55.74,7.96 R1.2
N$7  (via drill 0.25)
  Top 0.635: R24.2 15.57,10.34 v15.59,10.36 | v18.61,12.83 K1.6
  Bottom 0.635: v15.59,10.36 16.74,10.36 18.61,12.23 v18.61,12.83
N$8
  Top 0.635: U2.2 85.55,28.55 86.17,29.17 R3.3
N$9  (via drill 0.25)
  Top 0.203: U5.3 47.39,30.97 | U5.2 47.4,30.98
  Top 0.381: 47.39,30.97 47.4,30.98
  Top 0.635: v46.92,31.46 47.4,30.98 47.42,30.98 47.55,30.85
  Bottom 0.635: L1.1 C8.2 46.59,31.13 v46.92,31.46
N$10  (via drill 0.25)
  Top 0.635: D2.1 86.33,38.16 v88.24,40.07
  Bottom 0.635: v88.24,40.07 90.23,40.07 92.08,38.22 J2.1
N$11
  Top 0.635: U3.5 79.04,31.7 C2.2 R6.1
N$12
  Top 0.18: C18.2 L3.1 ANT1.2
N$13
  Top 0.18: L2.2 53.63,34.62 56.34,37.33 Y1.1 C14.2
N$14
  Top 0.18: U1.6 49.29,10.22 J1.B6 49.29,7.99 49.16,7.86 48.41,7.86 48.29,7.98 J1.A6
N$15
  Top 0.305: Q2.7 Q2.6
  Top 0.59: Q2.7 68.38,27.93
  Top 0.635: 68.38,27.93 68,28.3 68,30 71.5,33.5 C2.1 | U3.6 79.89,33.5 C2.1 | D2.2 81.93,34.41 C2.1
N$16
  Top 0.635: U8.4 C20.2
N$17
  Top 0.635: C23.2 U9.4
N$19
  Top 0.18: J5.19 R18.2
N$20
  Top 0.18: PROGRAM.2 86.08,5 R26.1
N$21
  Top 0.18: U5.50 53.32,32.06 58.07,32.06 58.62,31.51 R7.2
N$22
  Top 0.18: U5.49 53.54,31.72 54.01,31.72 R8.2
N$23
  Top 0.635: Q1.3 R6.2 86.77,30.17 88.08,31.48 U2.5 88.08,37.73 J2.2 92.06,41.74 C3.1
N$25
  Top 0.18: U5.30 50,22.43 50,19.05 R9.2
N$26
  Top 0.18: U5.31 50.83,22.16 50.83,20.41 R10.2
N$28
  Top 0.635: U4.3 81.74,26.07 Q1.2 | D1.1 79.03,21.77
  Top 1.5: D1.1 81.72,21.74 U4.3
N$29
  Top 0.18: U5.33 53.02,21.1 R11.2
N$30
  Top 0.18: U5.34 52.39,22.3 54.11,22.3 R12.2
N$31
  Top 0.18: U5.35 51.47,23.79 55.2,23.79 R13.2
N$45
  Top 0.18: J5.17 12.87,31.12 7.88,31.12 R19.2
N$50
  Top 0.18: C25.1 R17.2 J5.23
SPICLK  (via drill 0.25)
  Top 0.18: U7.6 56.3,14.18 58.38,14.18 59.1,14.9 | v59.9,14.9 59.1,14.9 | 59.1,14.9 59.1,15.12 R11.1
  Bottom 0.18: U6.SCLK 60.62,14.18 v59.9,14.9
SPICLK_N  (via drill 0.25)
  Top 0.18: U5.36 51.45,24.37 v53.72,24.37 | J5.13 v17.89,29.06
  Bottom 0.18: v53.72,24.37 52.59,25.5 50.6,25.5 49,23.9 48.2,23.9 44.8,27.3 34.1,27.3 29.7,31.7 20.53,31.7 v17.89,29.06
SPICS0
  Top 0.18: U7.1 61.7,15.99 | 61.7,15.99 61.67,15.96 59.3,15.96 54.39,20.88 54.09,20.88 53.12,19.92 52.95,19.92 51.93,20.94 51.93,21.63 U5.32 | 61.7,15.99 R14.1
SPICS1  (via drill 0.25)
  Top 0.18: U5.28 47.51,22.29 v47.51,21.59
  Bottom 0.18: R29.1 55.76,14.01 55.76,15.48 U6.CE# 55.25,15.77 53.43,15.77 | v47.51,21.59 53.33,15.77 53.43,15.77 | 53.43,15.77 53.43,15.76
SPID  (via drill 0.25)
  Top 0.18: v53.7,16.6 53.71,16.59 53.71,15.19 U7.5 55.42,15.1 v57.8,15.1 | R13.1 v57.45,21.54 v57.45,21.53
  Bottom 0.18: v53.7,16.6 53.72,16.6 57.45,20.33 v57.45,21.53 | v57.8,15.1 v57.8,15.11 58.16,15.47 61.16,15.47 U6.SI/SIO[0]
SPIHD  (via drill 0.25)
  Top 0.18: R9.1 51.73,15.17 55.1,11.8 55.71,11.8 U7.7 57.31,13.4 v57.9,13.4
  Bottom 0.18: U6.SIO[3] 59.63,13.4 v57.9,13.4
SPIQ  (via drill 0.25)
  Top 0.18: R12.1 55.41,20.9 v59.7,16.61 v59.7,16.6 60.51,16.6 U7.2
  Bottom 0.18: v59.7,16.6 56.44,16.6 U6.SO/SIO[1]
SPIWP  (via drill 0.25)
  Top 0.18: v59.4,17.8 59.92,17.8 U7.3 | R10.1 54.24,17 v55,17
  Bottom 0.18: v59.4,17.8 58.98,17.38 57.45,17.38 U6.SIO[2] 57.05,17.57 55.97,17.57 55.39,17 v55,17
U0RXD
  Top 0.18: R7.1 60.4,29.71 75.31,14.81 79.85,14.81 J9.1 J3.3
U0TXD
  Top 0.18: R8.1 56.51,31.72 57.93,31.72 75.17,14.48 77.64,14.48 J9.2 J3.4
USB_D_N
  Top 0.18: U1.3 47.59,13.3 48.06,13.77 48.22,13.77 48.37,13.93 48.37,13.98 45.92,16.44 45.92,22.4 U5.25
USB_D_P
  Top 0.18: U1.1 49.49,13.41 49.05,13.85 48.88,13.85 48.71,14.02 48.71,14.12 46.25,16.58 46.25,22.16 U5.26
V_BATT
  Top 1.5: U4.4 92.05,15.73 SW1.3
  Top 2: U4.2 U4.4
V_USB  (via drill 0.25)
  Top 0.635: R4.2 C1.2 | C1.2 88.5,27.18 U2.4 88.08,26.79 87.2,25.9 | 87.2,25.9 83.87,25.9 Q1.1 | U2.8 84.28,32.52 v85.44,31.35 | C1.2 89.53,27.76 v89.04,28.25 | J1.A4_B9 46.14,10.84 46.85,11.55 48.21,11.55 | 48.21,11.55 48.54,11.22 U1.5 48.54,11.23 48.86,11.55 | J1.B4_A9 v50.94,9.75 | v50.44,11.55 48.86,11.55 | 48.86,11.55 48.21,11.55 | v71.94,24.75 74.6,22.09 D1.2 | v85.44,24.95 86.25,24.95 87.2,25.9
  Bottom 0.635: v85.44,31.35 85.64,31.35 88.74,28.25 v89.04,28.25 | v50.94,9.75 50.94,11.05 v50.44,11.55 53.25,11.55 56,8.8 60.6,8.8 65.1,13.3 65.1,21.9 67.95,24.75 v71.94,24.75 85.24,24.75 v85.44,24.95
VDD_SPI  (via drill 0.25)
  Top 0.18: U5.29 49.21,22.65 | 49.19,21.17 v49.21,21.19
  Top 0.27: 49.21,22.65 v49.21,21.19 | 49.19,21.17 49.19,16.71 55,10.9 56.61,10.9 | 56.61,10.9 U7.8 | U7.8 57.72,12.01 60.23,12.01 R14.2 | U7.8 57.3,11.57 | 56.61,10.9 58.18,10.9 v58.43,11.15
  Bottom 0.18: C7.2
  Bottom 0.27: R29.2 56.71,12.38 U6.VCC 58.86,11.58 v58.43,11.15
  Bottom 0.381: C7.2 C6.2 50.36,21.19 v49.21,21.19
VIN
  Bottom 0.635: J3.2 84.26,9.14 85.3,8.1 88.08,8.1 91.68,11.7 SW1.1
XTAL_32K_N
  Top 0.18: C17.1 Y2.1 42.81,20.98 46.26,24.43 U5.22
XTAL_32K_P
  Top 0.18: U5.21 40.71,19.45 Y2.2 40.31,21.33 C16.1
XTAL_N
  Top 0.18: 50.71,31.15 U5.53 54.43,34.87 54.93,34.87 57.25,37.19 58.07,37.19 Y1.3 C15.2
XTAL_P
  Top 0.18: L2.1 51.85,32.86 U5.54 49.83,30.84

### Text on the board
tPlace: - VBATT + | IO37 | IO36 | IO10 | IO9 | IO35 | IO38 | IO3 | IO21 | VBATT | TX | RX | 3.3V | VIN | RST | IO0 | TX | RX | VIN | GND